# EasyEDA Pro project 电压表指示器.eprj

# Schematic 主板
Create Date: 2023-12-25; Page Name: P1; Project Name: 电压表指示器; Schematic Name: 主板; Update Date: 2024-02-02; Company: 嘉立创EDA; Page Size: A4; Version: V1.0
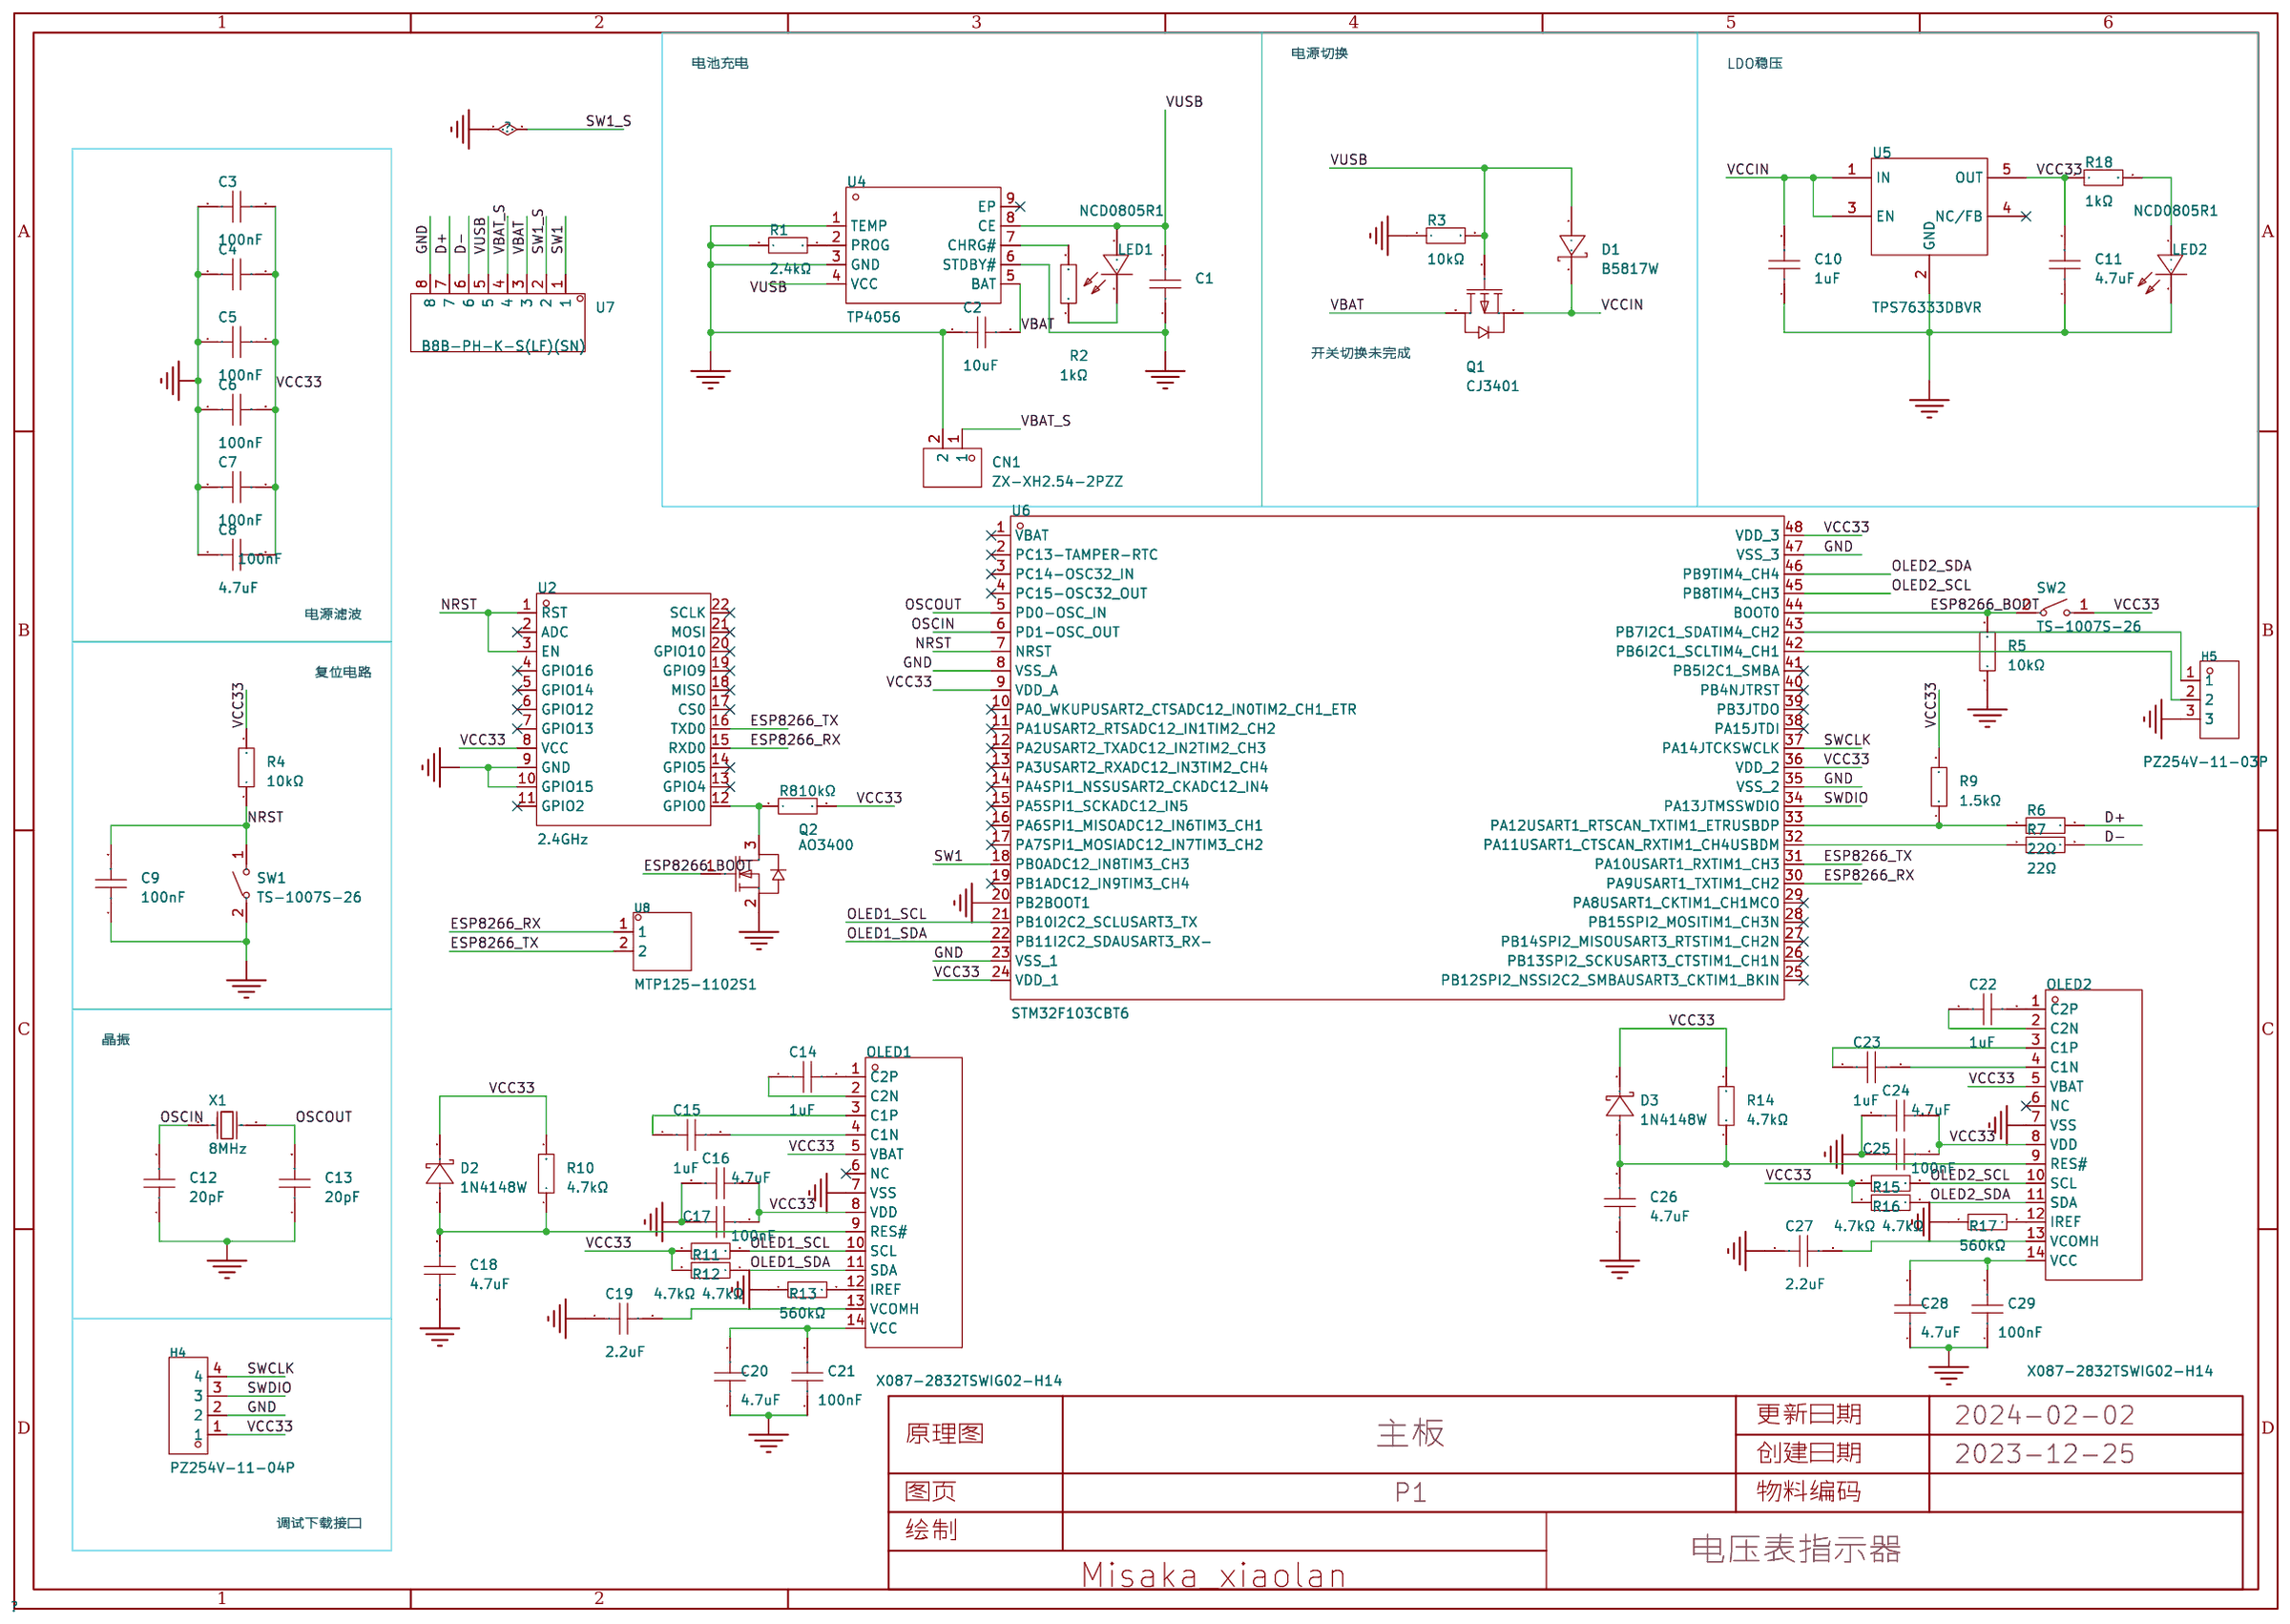
[diagram p0: schematic sheet]

## Parts
C1  10uF  [C0603]
C2  10uF  [C0603]
C3  100nF  [C0603]
C4  100nF  [C0603]
C5  100nF  [C0603]
C6  100nF  [C0603]
C7  100nF  [C0603]
C8  4.7uF  [C0603]
C9  100nF  [C0603]
C10  1uF  [C0603]
C11  4.7uF  [C0603]
C12  20pF  [C0603]
C13  20pF  [C0603]
C14  1uF  [C0603]
C15  1uF  [C0603]
C16  4.7uF  [C0603]
C17  100nF  [C0603]
C18  4.7uF  [C0603]
C19  2.2uF  [C0603]
C20  4.7uF  [C0603]
C21  100nF  [C0603]
C22  1uF  [C0603]
C23  1uF  [C0603]
C24  4.7uF  [C0603]
C25  100nF  [C0603]
C26  4.7uF  [C0603]
C27  2.2uF  [C0603]
C28  4.7uF  [C0603]
C29  100nF  [C0603]
CN1  ZX-XH2.54-2PZZ  [CONN-TH_2P-P2.50_HX25003-2A]
D1  B5817W  [SOD-123_L2.7-W1.6-LS3.7-RD]
D2  1N4148W  [SOD-123_L2.7-W1.6-LS3.7-FD]
D3  1N4148W  [SOD-123_L2.7-W1.6-LS3.7-FD]
H4  PZ254V-11-04P  [HDR-TH_4P-P2.54-V-M]
H5  PZ254V-11-03P  [HDR-TH_3P-P2.54-V-M]
LED1  NCD0805R1  [LED0805-R-RD]
LED2  NCD0805R1  [LED0805-R-RD]
OLED1  X087-2832TSWIG02-H14  [OLED-SMD_X087-2832TSWIG02-H14]
OLED2  X087-2832TSWIG02-H14  [OLED-SMD_X087-2832TSWIG02-H14]
Q1  CJ3401  [SOT-23-3_L2.9-W1.6-P1.90-LS2.8-BR]
Q2  AO3400  [SOT-23_L2.9-W1.3-P1.90-LS2.4-BR]
R1  2.4kΩ  [R0603]
R2  1kΩ  [R0603]
R3  10kΩ  [R0603]
R4  10kΩ  [R0603]
R5  10kΩ  [R0603]
R6  22Ω  [R0603]
R7  22Ω  [R0603]
R8  10kΩ  [R0603]
R9  1.5kΩ  [R0603]
R10  4.7kΩ  [R0603]
R11  4.7kΩ  [R0603]
R12  4.7kΩ  [R0603]
R13  560kΩ  [R0603]
R14  4.7kΩ  [R0603]
R15  4.7kΩ  [R0603]
R16  4.7kΩ  [R0603]
R17  560kΩ  [R0603]
R18  1kΩ  [R0603]
SW1  TS-1007S-26  [SW-SMD_L6.1-W3.7-LS7.9]
SW2  TS-1007S-26  [SW-SMD_L6.1-W3.7-LS7.9]
U2  2.4GHz  [WIFIM-SMD_ESP-12F-ESP8266MOD]
U4  TP4056  [ESOP-8_L4.9-W3.9-P1.27-LS6.0-BL-EP]
U5  TPS76333DBVR  [SOT-23-5_L3.0-W1.7-P0.95-LS2.8-BR]
U6  STM32F103CBT6  [LQFP-48_L7.0-W7.0-P0.50-LS9.0-BL]
U7  B8B-PH-K-S(LF)(SN)  [CONN-TH_B8B-PH-K-S-LF-SN]
U8  MTP125-1102S1  [HDR-TH_2P-P2.54-V-M-1]
X1  8MHz  [CRYSTAL-SMD_L11.5-W4.8-LS12.7]

## Library data of the parts
C1 C2 = CL10A106MQ8NNNC: 容值:10uF;精度:±20%;额定电压:6.3V;材质(温度系数):X5R;; LCSC Part Name: 10uF ±20% 6.3V; Supplier Part: C1691; Manufacturer: SAMSUNG(三星); Supplier Footprint: 0603; JLCPCB Part Class: Extended Part; Datasheet: https://atta.szlcsc.com/upload/public/pdf/source/20160218/1457707763339.pdf; Supplier: LCSC; Tolerance: ±20%; Voltage Rated: 6.3V; Temperature Coefficient: X5R
C3-C7 C9 C17 C21 C25 C29 = TCC0603X7R104K500CT: 容值:100nF;精度:±10%;额定电压:50V;材质(温度系数):X7R;; LCSC Part Name: 100nF ±10% 50V; Supplier Part: C282519; Manufacturer: CCTC(三环); Supplier Footprint: 0603; JLCPCB Part Class: Extended Part; Datasheet: https://atta.szlcsc.com/upload/public/pdf/source/20191203/C466239_F62A586702D44EEA1C39B32FC8662B21.pdf; Supplier: LCSC; Tolerance: ±10%; Voltage Rated: 50V; Temperature Coefficient: X7R
C8 C11 C16 C18 C20 C24 C26 C28 = CL10A475KQ8NNNC: 容值:4.7uF;精度:±10%;额定电压:6.3V;材质(温度系数):X5R;; LCSC Part Name: 4.7uF ±10% 6.3V; Supplier Part: C8032; Manufacturer: SAMSUNG(三星); Supplier Footprint: 0603; JLCPCB Part Class: Extended Part; Datasheet: https://atta.szlcsc.com/upload/public/pdf/source/20221010/F95B0006E4929BBC4EB5850E0BA49567.pdf; Supplier: LCSC; Tolerance: ±10%; Voltage Rated: 6.3V; Temperature Coefficient: X5R
C10 C14 C15 C22 C23 = CL10A105KO8NNNC: 容值:1uF;精度:±10%;额定电压:16V;材质(温度系数):X5R;; LCSC Part Name: 1uF ±10% 16V; Supplier Part: C1592; Manufacturer: SAMSUNG(三星); Supplier Footprint: 0603; JLCPCB Part Class: Extended Part; Datasheet: https://atta.szlcsc.com/upload/public/pdf/source/20220919/9FBE606BE0D9532D730F292EB26DC5BB.pdf; Supplier: LCSC; Tolerance: ±10%; Voltage Rated: 16V; Temperature Coefficient: X5R
C12 C13 = CC0603JRNPO9BN200: 容值:20pF;精度:±5%;额定电压:50V;材质(温度系数):NP0;; LCSC Part Name: 20pF ±5% 50V; Supplier Part: C105621; Manufacturer: YAGEO(国巨); Supplier Footprint: 0603; JLCPCB Part Class: Extended Part; Datasheet: https://atta.szlcsc.com/upload/public/pdf/source/20170505/1493957838062.pdf; Supplier: LCSC; Tolerance: ±5%; Voltage Rated: 50V; Temperature Coefficient: NP0
C19 C27 = CL10A225KO8NNNC: 容值:2.2uF;精度:±10%;额定电压:16V;材质(温度系数):X5R;; LCSC Part Name: 2.2uF ±10% 16V; Supplier Part: C23630; Manufacturer: SAMSUNG(三星); Supplier Footprint: 0603; JLCPCB Part Class: Basic Part; Datasheet: https://atta.szlcsc.com/upload/public/pdf/source/20160218/1457707763339.pdf; Supplier: LCSC; Tolerance: ±10%; Voltage Rated: 16V; Temperature Coefficient: X5R
CN1 = ZX-XH2.54-2PZZ: 插针结构:1x2P;间距:2.54mm;安装方式:直插;行距:-;总PIN数:2P;排数:1;每排PIN数:2;参考系列:XH;额定电流:3A;触头材质:黄铜;触头镀层:锡;工作温度范围:-25℃~+85℃;; LCSC Part Name: 1x2P 间距:2.54mm 直插 系列:XH; Supplier Part: C7429632; Manufacturer: Megastar(兆星); Supplier Footprint: 插件,P=2.54mm; JLCPCB Part Class: Extended Part; Datasheet: https://atta.szlcsc.com/upload/public/pdf/source/20230619/19BA6947230AA44A04D3EDD65E618FD0.pdf; Supplier: LCSC; Pins Structure: 1x2P; Pitch: 2.54mm; Mounting Style: 直插; Number of Pins: 2P; Number of Rows: 1; Number of PINs Per Row: 2; Reference Series: XH; Current Rating (Max): 3A; Contact Material: 黄铜; Contact Plating: 锡; Operating Temperature Range: -25℃~+85℃
D1 = B5817W_C511870: 正向压降(Vf):750mV@3A;直流反向耐压(Vr):20V;平均整流电流(Io):1A;; LCSC Part Name: 电压:20V 电流:1A; Supplier Part: C511870; Manufacturer: BORN(伯恩半导体); Supplier Footprint: SOD-123; JLCPCB Part Class: 扩展库; Datasheet: https://atta.szlcsc.com/upload/public/pdf/source/20200413/C511870_62B338FDEC2CADE0DB74DDD9EC04EFF4.pdf; Supplier: LCSC; Forward Voltage (Vf@If): 750mV@3A; Reverse Voltage (Vr): 20V; Average Rectified Current (Io): 1A
D2 D3 = 1N4148W_C7420318: 二极管配置:独立式;正向压降(Vf):1.25V@150mA;直流反向耐压(Vr):100V;平均整流电流(Io):150mA;功率:400mW;反向恢复时间(trr):4ns;; LCSC Part Name: 电压:100V 电流:150mA; Supplier Part: C7420318; Manufacturer: 宏迦橙; Supplier Footprint: SOD-123; JLCPCB Part Class: 扩展库; Datasheet: https://atta.szlcsc.com/upload/public/pdf/source/20230828/E5C3F7A4272052930A7E03B75759BF50.pdf; Supplier: LCSC; Diode Configuration: 独立式; Forward Voltage (Vf@If): 1.25V@150mA; Reverse Voltage (Vr): 100V; Average Rectified Current (Io): 150mA; Power Dissipation: 400mW; Reverse Leakage Current: 1uA@75V; Reverse Recovery Time (trr): 4ns; Operating Temperature: -55℃~+150℃
H4 = PZ254V-11-04P: 排数:单排;总PIN位数:4P;间距:2.54mm;插针结构:1x4P;行距:-;安装类型:直插;圆针/方针:方针;额定电流:3A;额定电压:250V;配合针长度:6mm;塑高:2.5mm;端接针长度:3mm;触头材质:-;工作温度范围:-40℃~+105℃;颜色:黑色;; LCSC Part Name: 2.54mm 1x4P 直插 方针; Supplier Part: C2691448; Manufacturer: XFCN(兴飞); Supplier Footprint: 插件,P=2.54mm; JLCPCB Part Class: 扩展库; Datasheet: https://atta.szlcsc.com/upload/public/pdf/source/20200309/C492403_F9F19131791D08044AD4F84F8E751A34.pdf; Supplier: LCSC; Number of Rows: 单排; Number of Pins: 4P; Pitch: 2.54mm; Pin Structure: 1x4P; Mounting Type: 直插; Circluar Pins/Square Pins: 方针; Current Rating (Max): 3A; Voltage Rating (Max): 250V; Length of Mating Pin: 6mm; Insulation Height: 2.5mm; Length of End Connection Pin: 3mm; Operating Temperature Range: -40℃~+105℃; Color: 黑色
H5 = PZ254V-11-03P: 排数:单排;总PIN位数:3;间距:2.54mm;插针结构:1x3P;行距:-;安装类型:直插;圆针/方针:方针;额定电流:3A;额定电压:250V;配合针长度:6mm;塑高:2.5mm;端接针长度:3mm;工作温度范围:-40℃~+105℃;颜色:黑色;; LCSC Part Name: 2.54mm 1x3P 直插 方针; Supplier Part: C2937625; Manufacturer: XFCN(兴飞); Supplier Footprint: 直插,P=2.54mm; JLCPCB Part Class: Extended Part; Datasheet: 2022-07-12/581362A/62b9d00620994b3696be7eb4af85ad72/双排排针和单排排针.pdf; Supplier: LCSC; Number of Rows: 单排; Number of Pins: 3; Pitch: 2.54mm; Pin Structure: 1x3P; Mounting Type: 直插; Circluar Pins/Square Pins: 方针; Current Rating (Max): 3A; Voltage Rating (Max): 250V; Length of Mating Pin: 6mm; Insulation Height: 2.5mm; Length of End Connection Pin: 3mm; Operating Temperature Range: -40℃~+105℃; Color: 黑色
LED1 LED2 = NCD0805R1: 发光颜色:红色;二极管配置:-;功率:65mW;透镜颜色:无色透明;主波长:615nm~630nm;色温:-;发光强度:67mcd~195mcd;发光角度:130°;安装方式:-;工作温度:-30℃~+85℃;; LCSC Part Name: 红灯 0805红灯   正贴; Supplier Part: C84256; Manufacturer: 国星光电; Supplier Footprint: 0805; JLCPCB Part Class: Basic Part; Datasheet: https://atta.szlcsc.com/upload/public/pdf/source/20200820/C84256_F0A75A43B3EAD75808600A0514C76B99.pdf; Supplier: LCSC; Emitted Color: 红色; Forward Voltage (VF): 1.6V~2.6V; Forward Current: 20mA; Power Dissipation: 65mW; Lens Color: 无色透明; Dominant Wavelength: 615nm~630nm; Luminous Intensity: 67mcd~195mcd; Viewing Angle: 130°; Operating Temperature: -30℃~+85℃
OLED1 OLED2 = X087-2832TSWIG02-H14: 显示屏; Supplier Part: C18723015; Manufacturer: Newvision(新智景); JLCPCB Part Class: Extended Part; Datasheet: https://atta.szlcsc.com/upload/public/pdf/source/20231103/222F0746A2795BBD5263EDDBD3E1B824.pdf; Supplier: LCSC
Q1 = CJ3401: 类型:P沟道;漏源电压(Vdss):30V;连续漏极电流(Id):4.2A;功率(Pd):350mW;导通电阻(RDS(on)@Vgs,Id):65mΩ@10V,4.2A;; LCSC Part Name: P沟道 30V 4.2A; Supplier Part: C13799; Manufacturer: CJ(江苏长电/长晶); Supplier Footprint: SOT-23; JLCPCB Part Class: 扩展库; Datasheet: https://atta.szlcsc.com/upload/public/pdf/source/20140815/1457707217656.pdf; Supplier: LCSC; Type: P沟道; Drain Source Voltage (Vdss): 30V; Continuous Drain Current (Id): 4.2A; Power Dissipation (Pd): 350mW; Drain Source On Resistance (RDS(on)@Vgs,Id): 65mΩ@10V,4.2A; Gate Threshold Voltage (Vgs(th)@Id): 1.3V@250uA
Q2 = AO3400_C2938367: 类型:N沟道;漏源电压(Vdss):30V;连续漏极电流(Id):5.8A;功率(Pd):1.5W;导通电阻(RDS(on)@Vgs,Id):35mΩ@10V,5.8A;阈值电压(Vgs(th)@Id):1.2V@250uA;; LCSC Part Name: N沟道 耐压:30V 电流:5.8A; Supplier Part: C2938367; Manufacturer: GOODWORK(固得沃克); Supplier Footprint: SOT-23; JLCPCB Part Class: 扩展库; Datasheet: https://atta.szlcsc.com/upload/public/pdf/source/20211229/1DE691E24B5B31BB262C463D0489A9AB.pdf; Supplier: LCSC; Type: N沟道; Drain Source Voltage (Vdss): 30V; Continuous Drain Current (Id): 5.8A; Power Dissipation (Pd): 1.5W; Drain Source On Resistance (RDS(on)@Vgs,Id): 35mΩ@10V,5.8A; Gate Threshold Voltage (Vgs(th)@Id): 1.2V@250uA; Input Capacitance (Ciss@Vds): 1.05nF@15V; Reverse Transfer Capacitance (Crss@Vds): 77pF@15V
R1 = 0603WAF2401T5E: 阻值:2.4kΩ;精度:±1%;功率:100mW;温度系数:±100ppm/℃;电阻类型:厚膜电阻;; LCSC Part Name: 2.4kΩ ±1% 100mW 厚膜电阻; Supplier Part: C22940; Manufacturer: UNI-ROYAL(厚声); Supplier Footprint: 0603; JLCPCB Part Class: Basic Part; Datasheet: https://atta.szlcsc.com/upload/public/pdf/source/20200306/C422600_1E6D84923E4A46A82E41ADD87F860B5C.pdf; Supplier: LCSC; Tolerance: ±1%; Power(Watts): 100mW; Overload Voltage (Max): 75V; Temperature Coefficient: ±100ppm/℃; Type: 厚膜电阻; Operating Temperature Range: -55℃~+155℃
R2 R18 = 0603WAF1001T5E: 阻值:1kΩ;精度:±1%;功率:100mW;温度系数:±100ppm/℃;电阻类型:厚膜电阻;; LCSC Part Name: 1kΩ ±1% 100mW 厚膜电阻; Supplier Part: C21190; Manufacturer: UNI-ROYAL(厚声); Supplier Footprint: 0603; JLCPCB Part Class: Basic Part; Datasheet: https://atta.szlcsc.com/upload/public/pdf/source/20200306/C422600_1E6D84923E4A46A82E41ADD87F860B5C.pdf; Supplier: LCSC; Tolerance: ±1%; Power(Watts): 100mW; Overload Voltage (Max): 75V; Temperature Coefficient: ±100ppm/℃; Type: 厚膜电阻; Operating Temperature Range: -55℃~+155℃
R3-R5 R8 = SC0603J1002F2BNRH: 阻值:10kΩ;精度:±5%;功率:-;温度系数:±100ppm/℃;; LCSC Part Name: 10kΩ ±5%; Supplier Part: C3152154; Manufacturer: Sunway(信维通信); Supplier Footprint: 0603; JLCPCB Part Class: Extended Part; Datasheet: https://atta.szlcsc.com/upload/public/pdf/source/20220728/FFCE43BB6DF8FA16AEE331F0F4B289DE.pdf; Supplier: LCSC; Tolerance: ±5%; Temperature Coefficient: ±100ppm/℃; Overload Voltage (Max): 150V; Type: 厚膜电阻; Operating Temperature Range: -55℃~+155℃
R6 R7 = RS-03K220JT: 精度:±5%;温度系数:±100ppm/℃;功率:100mW;阻值:22Ω;最大工作电压:50V;工作温度范围:-55℃~+155℃;; LCSC Part Name: 22Ω(220) ±5%; Supplier Part: C96423; Manufacturer: FH(风华); Supplier Footprint: 0603; JLCPCB Part Class: Extended Part; Datasheet: https://atta.szlcsc.com/upload/public/pdf/source/20171212/C96423_15130640232351178030.pdf; Supplier: LCSC; Tolerance: ±5%; Temperature Coefficient: ±100ppm/℃; Power(Watts): 100mW; Overload Voltage (Max): 50V; Operating Temperature Range: -55℃~+155℃; Type: 厚膜电阻
R9 = 0603WAJ0152T5E: 阻值:1.5kΩ;精度:±5%;功率:100mW;温度系数:±100ppm/℃;电阻类型:厚膜电阻;; LCSC Part Name: 1.5kΩ ±5% 100mW 厚膜电阻; Supplier Part: C25989; Manufacturer: UNI-ROYAL(厚声); Supplier Footprint: 0603; JLCPCB Part Class: Extended Part; Datasheet: https://atta.szlcsc.com/upload/public/pdf/source/20200306/C422600_1E6D84923E4A46A82E41ADD87F860B5C.pdf; Supplier: LCSC; Tolerance: ±5%; Power(Watts): 100mW; Overload Voltage (Max): 75V; Temperature Coefficient: ±100ppm/℃; Type: 厚膜电阻; Operating Temperature Range: -55℃~+155℃
R10-R12 R14-R16 = RTT03472JTP: 电阻类型:厚膜电阻;阻值:4.7kΩ;精度:±5%;功率:100mW;; LCSC Part Name: 4.7kΩ ±5% 100mW; Supplier Part: C103662; Manufacturer: RALEC(旺诠); Supplier Footprint: 0603; JLCPCB Part Class: Extended Part; Datasheet: https://atta.szlcsc.com/upload/public/pdf/source/20170408/1491646290802.pdf; Supplier: LCSC; Type: 厚膜电阻; Tolerance: ±5%; Power(Watts): 100mW; Temperature Coefficient: ±100ppm/℃; Overload Voltage (Max): 75V; Operating Temperature Range: -55℃~+155℃
R13 R17 = 0603WAF5603T5E: 阻值:560kΩ;精度:±1%;功率:100mW;温度系数:±100ppm/℃;电阻类型:厚膜电阻;; LCSC Part Name: 560kΩ ±1% 100mW 厚膜电阻; Supplier Part: C23203; Manufacturer: UNI-ROYAL(厚声); Supplier Footprint: 0603; JLCPCB Part Class: Basic Part; Datasheet: https://atta.szlcsc.com/upload/public/pdf/source/20200306/C422600_1E6D84923E4A46A82E41ADD87F860B5C.pdf; Supplier: LCSC; Tolerance: ±1%; Power(Watts): 100mW; Overload Voltage (Max): 75V; Temperature Coefficient: ±100ppm/℃; Type: 厚膜电阻; Operating Temperature Range: -55℃~+155℃
SW1 SW2 = TS-1007S-26: 电路结构:单刀单掷;触点电流:50mA;额定电压(DC):12V;安装方式:立贴;带灯:-;机械寿命:-;; LCSC Part Name: 6.1*3.6*2.5mm 立贴 轻触开关; Supplier Part: C455236; Manufacturer: XUNPU(讯普); Supplier Footprint: SMD,3.6x6.1mm; JLCPCB Part Class: 扩展库; Datasheet: https://atta.szlcsc.com/upload/public/pdf/source/20191118/C455236_7E7538F01DDF6B1FD919FA3ED2D84847.pdf; Supplier: LCSC; Circuit: 单刀单掷; Actuator Style: 矩形按钮; Switch Length: 6.1mm; Switch Width: 3.6mm; Switch Height: 2.5mm; Contact Current: 50mA; Voltage Rating (DC): 12V; Mounting Style: 立贴
U2 = ESP-12F(ESP8266MOD): 频率:2.4GHz;发射功率:16dBm;核心处理器:ESP8266;天线形式:PCB 板载天线;接收灵敏度:-90dBm;; LCSC Part Name: 完整的802.11b/g/n Wi-Fi的SoC模块; Supplier Part: C82891; Manufacturer: Ai-Thinker(安信可); Supplier Footprint: SMD,16x24mm; JLCPCB Part Class: 扩展库; Datasheet: https://atta.szlcsc.com/upload/public/pdf/source/20210219/C82891_ABD84A460F4F056A2757267CCCA4B508.pdf; Supplier: LCSC; Output Power: 16dBm; Core Processor: ESP8266; Support Interface: GPIO；UART；I2C；PWM；SPI；ADC; Antenna Type: PCB 板载天线; Wireless Standard: 802.11b/g/n; Operating Voltage: 3.3V; Receive  Current: 120mA; Send  Current: 170mA; Sensitivity: -90dBm; Operating Temperature: -40℃~+85℃
U4 = TP4056_C725790: Supplier Part: C725790; Manufacturer: UMW(友台半导体); Supplier Footprint: ESOP-8; JLCPCB Part Class: 扩展库; Datasheet: https://atta.szlcsc.com/upload/public/pdf/source/20231109/CF74897CE79A500F7FE27A45ADCCC631.pdf; Supplier: LCSC
U5 = TPS76333DBVR: 输出类型:固定;最大输入电压:10V;输出电流:150mA;输出电压（最小值/固定值）:3.3V;; Supplier Part: C7100; Manufacturer: TI(德州仪器); Supplier Footprint: SOT-23-5; JLCPCB Part Class: 扩展库; Datasheet: https://atta.szlcsc.com/upload/public/pdf/source/20140704/1457707103369.pdf; Supplier: LCSC
U6 = STM32F103CBT6: CPU内核:ARM Cortex-M3;CPU最大主频:72MHz;程序存储容量:128KB;程序存储器类型:FLASH;RAM总容量:20KB;GPIO端口数量:37;; LCSC Part Name: ARM Cortex-M3 72MHz; Supplier Part: C8304; Manufacturer: ST(意法半导体); Supplier Footprint: LQFP-48(7x7); JLCPCB Part Class: Extended Part; Datasheet: https://atta.szlcsc.com/upload/public/pdf/source/20140724/1457707170379.pdf; Supplier: LCSC; CPU Core: ARM Cortex-M3; CPU Maximum Speed: 72MHz; Operating Voltage Range: 2V~3.6V; Program Storage Size: 128KB; Program Memory Type: FLASH; RAM Size: 20KB; GPIO Ports Number: 37; ADC (Bit): 12bit; Universal Serial Bus: 有; Peripheral/Function: DMA；片载温度传感器；PWM; Watchdog: 有; Infrared Data Association: 有; Low-Voltage Detect: 有; Direct Memory Access: 有; Internal Oscillator: 有; Operating Temperature Range: -40℃~+85℃
U7 = B8B-PH-K-S(LF)(SN): 插针结构:1x8P;间距:2mm;安装方式:-;行距:-;总PIN数:8P;排数:1;每排PIN数:8;参考系列:PH;触头材质:黄铜;; LCSC Part Name: 1x8P 间距:2mm 系列:PH; Supplier Part: C157974; Manufacturer: JST; Supplier Footprint: 插件,P=2mm; JLCPCB Part Class: 扩展库; Datasheet: https://atta.szlcsc.com/upload/public/pdf/source/20181010/C265101_22107ACC4D8714694FDA2DD97145FA81.pdf; Supplier: LCSC; Pins Structure: 1x8P; Pitch: 2mm; Number of Pins: 8P; Number of Rows: 1; Number of PINs Per Row: 8; Reference Series: PH; Contact Material: 黄铜
U8 = MTP125-1102S1: 排数:单排;总PIN位数:2P;间距:2.54mm;插针结构:1x2P;行距:-;安装类型:直插;圆针/方针:方针;额定电流:-;额定电压:-;配合针长度:6mm;塑高:2.5mm;端接针长度:3mm;触头材质:黄铜;触头镀层:-;工作温度范围:-40℃~+105℃;颜色:黑色;; LCSC Part Name: 2.54mm 1x2P 直插 方针 尖头 20181219110956; Supplier Part: C358684; Manufacturer: MINTRON(明硕); Supplier Footprint: 插件,P=2.54mm; JLCPCB Part Class: 扩展库; Datasheet: https://atta.szlcsc.com/upload/public/pdf/source/20190124/C358691_14EEE47B6F852A185E1BED738B24D535.pdf; Supplier: LCSC; Number of Rows: 单排; Number of Pins: 2P; Pitch: 2.54mm; Pin Structure: 1x2P; Mounting Type: 直插; Circluar Pins/Square Pins: 方针; Length of Mating Pin: 6mm; Insulation Height: 2.5mm; Length of End Connection Pin: 3mm; Contact Material: 黄铜; Operating Temperature Range: -40℃~+105℃; Color: 黑色
X1 = X49SM8MSD2SC: 晶振类型:49SMD晶振;频率:8MHz;频率公差:±20ppm;负载电容:20pF;频率稳定度:±30ppm;; LCSC Part Name: 8MHz ±20ppm 20pF; Supplier Part: C12674; Manufacturer: YXC(扬兴晶振); Supplier Footprint: HC-49S-SMD; JLCPCB Part Class: 基础库; Datasheet: https://atta.szlcsc.com/upload/public/pdf/source/20210329/C106809_0E91E60850A780B284B63D653DC40EA4.pdf; Supplier: LCSC; Crystal Type: 49SMD晶振; Frequency Tolerance: ±20ppm; Load Capacitance: 20pF; Frequency Stability: ±30ppm; Operating Temperature: -20℃~+70℃

## Nets
GND: C1.1 C2.2 C3.1 C4.1 C5.1 C6.1 C7.1 C8.1 C9.1 C10.1 C11.1 C12.1 C13.1 C16.1 C17.1 C18.1 C19.1 C20.1 C21.1 C24.1 C25.1 C26.1 C27.1 C28.1 C29.1 CN1.2 H4.2 H5.3 LED2.2(-) OLED1.7(VSS) OLED2.7(VSS) Q2.2(S) R1.1 R3.1 R5.1 R13.1 R17.1 SW1.2(B) U2.9(GND) U2.10(GPIO15) U4.1(TEMP) U4.3(GND) U4.6(STDBY#) U5.2(GND) U6.8(VSS_A) U6.20(PB2BOOT1) U6.23(VSS_1) U6.35(VSS_2) U6.47(VSS_3) U7.2 U7.8
VBAT: C2.1 Q1.3(D) U4.5(BAT) U7.3
VBAT_S: CN1.1 U7.4
VCC33: C3.2 C4.2 C5.2 C6.2 C7.2 C8.2 C11.2 C16.2 C17.2 C24.2 C25.2 D2.2(K) D3.2(K) H4.1 OLED1.5(VBAT) OLED1.8(VDD) OLED2.5(VBAT) OLED2.8(VDD) R4.2 R8.2 R9.2 R10.2 R11.1 R12.2 R14.2 R15.1 R16.2 R18.1 SW2.1(A) U2.8(VCC) U5.5(OUT) U6.9(VDD_A) U6.24(VDD_1) U6.36(VDD_2) U6.48(VDD_3)
VCCIN: C10.2 D1.1(K) Q1.2(S) U5.1(IN) U5.3(EN)
D+: R6.2 U7.7
D-: R7.2 U7.6
ESP8266_BOOT: Q2.1(G) R5.2 SW2.2(B) U6.44(BOOT0)
ESP8266_RX: U2.15(RXD0) U6.30(PA9USART1_TXTIM1_CH2) U8.1
ESP8266_TX: U2.16(TXD0) U6.31(PA10USART1_RXTIM1_CH3) U8.2
NRST: C9.2 R4.1 SW1.1(A) U2.1(RST) U2.3(EN) U6.7(NRST)
OLED1_SCL: OLED1.10(SCL) R11.2 U6.21(PB10I2C2_SCLUSART3_TX)
OLED1_SDA: OLED1.11(SDA) R12.1 U6.22(PB11I2C2_SDAUSART3_RX-)
OLED2_SCL: OLED2.10(SCL) R15.2 U6.45(PB8TIM4_CH3)
OLED2_SDA: OLED2.11(SDA) R16.1 U6.46(PB9TIM4_CH4)
OSCIN: C12.2 U6.6(PD1-OSC_OUT) X1.2(OSC2)
OSCOUT: C13.2 U6.5(PD0-OSC_IN) X1.1(OSC1)
SW1: U6.18(PB0ADC12_IN8TIM3_CH3) U7.1
SWCLK: H4.4 U6.37(PA14JTCKSWCLK)
SWDIO: H4.3 U6.34(PA13JTMSSWDIO)
VUSB: C1.2 D1.2(A) LED1.1(+) Q1.1(G) R3.2 U4.4(VCC) U4.8(CE) U7.5
$1N1538: R1.2 U4.2(PROG)
$1N1811: R2.2 U4.7(CHRG#)
$1N4842: R6.1 R9.1 U6.33(PA12USART1_RTSCAN_TXTIM1_ETRUSBDP)
$1N4845: R7.1 U6.32(PA11USART1_CTSCAN_RXTIM1_CH4USBDM)
$1N4965: Q2.3(D) R8.1 U2.12(GPIO0)
$1N5760: C14.2 OLED1.1(C2P)
$1N5788: C14.1 OLED1.2(C2N)
$1N5816: C15.1 OLED1.3(C1P)
$1N5820: C15.2 OLED1.4(C1N)
$1N6266: C18.2 D2.1(A) OLED1.9(RES#) R10.1
$1N6421: OLED1.12(IREF) R13.2
$1N6524: C19.2 OLED1.13(VCOMH)
$1N6632: C20.2 C21.2 OLED1.14(VCC)
$1N7134: C22.2 OLED2.1(C2P)
$1N7136: C22.1 OLED2.2(C2N)
$1N7139: C23.1 OLED2.3(C1P)
$1N7142: C23.2 OLED2.4(C1N)
$1N7156: C26.2 D3.1(A) OLED2.9(RES#) R14.1
$1N7178: OLED2.12(IREF) R17.2
$1N7182: C27.2 OLED2.13(VCOMH)
$1N7188: C28.2 C29.2 OLED2.14(VCC)
$1N10261: H5.1 U6.43(PB7I2C1_SDATIM4_CH2)
$1N10265: H5.2 U6.42(PB6I2C1_SCLTIM4_CH1)
Net-(LED1-2): LED1.2(-) R2.1
Net-(LED2-1): LED2.1(+) R18.2

Not connected (* = marked no-connect by the designer): OLED1 6(NC)*; OLED2 6(NC)*; U2 2(ADC)* 4(GPIO16)* 5(GPIO14)* 6(GPIO12)* 7(GPIO13)* 11(GPIO2)* 13(GPIO4)* 14(GPIO5)* 17(CS0)* 18(MISO)* 19(GPIO9)* 20(GPIO10)* 21(MOSI)* 22(SCLK)*; U4 9(EP)*; U5 4(NC/FB)*; U6 1(VBAT)* 2(PC13-TAMPER-RTC)* 3(PC14-OSC32_IN)* 4(PC15-OSC32_OUT)* 10(PA0_WKUPUSART2_CTSADC12_IN0TIM2_CH1_ETR)* 11(PA1USART2_RTSADC12_IN1TIM2_CH2)* 12(PA2USART2_TXADC12_IN2TIM2_CH3)* 13(PA3USART2_RXADC12_IN3TIM2_CH4)* 14(PA4SPI1_NSSUSART2_CKADC12_IN4)* 15(PA5SPI1_SCKADC12_IN5)* 16(PA6SPI1_MISOADC12_IN6TIM3_CH1)* 17(PA7SPI1_MOSIADC12_IN7TIM3_CH2)* 19(PB1ADC12_IN9TIM3_CH4)* 25(PB12SPI2_NSSI2C2_SMBAUSART3_CKTIM1_BKIN)* 26(PB13SPI2_SCKUSART3_CTSTIM1_CH1N)* 27(PB14SPI2_MISOUSART3_RTSTIM1_CH2N)* 28(PB15SPI2_MOSITIM1_CH3N)* 29(PA8USART1_CKTIM1_CH1MCO)* 38(PA15JTDI)* 39(PB3JTDO)* 40(PB4NJTRST)* 41(PB5I2C1_SMBA)*

## Notes on the sheet
- 电源切换
- 电池充电
- LDO稳压
- 开关切换未完成
- 电源滤波
- 复位电路
- 晶振
- 调试下载接口

# Schematic 接线板
Create Date: 2023-12-30; Page Name: P1; Project Name: 电压表指示器; Schematic Name: 接线板; Update Date: 2023-12-30; Company: 嘉立创EDA; Page Size: A4; Version: V1.0
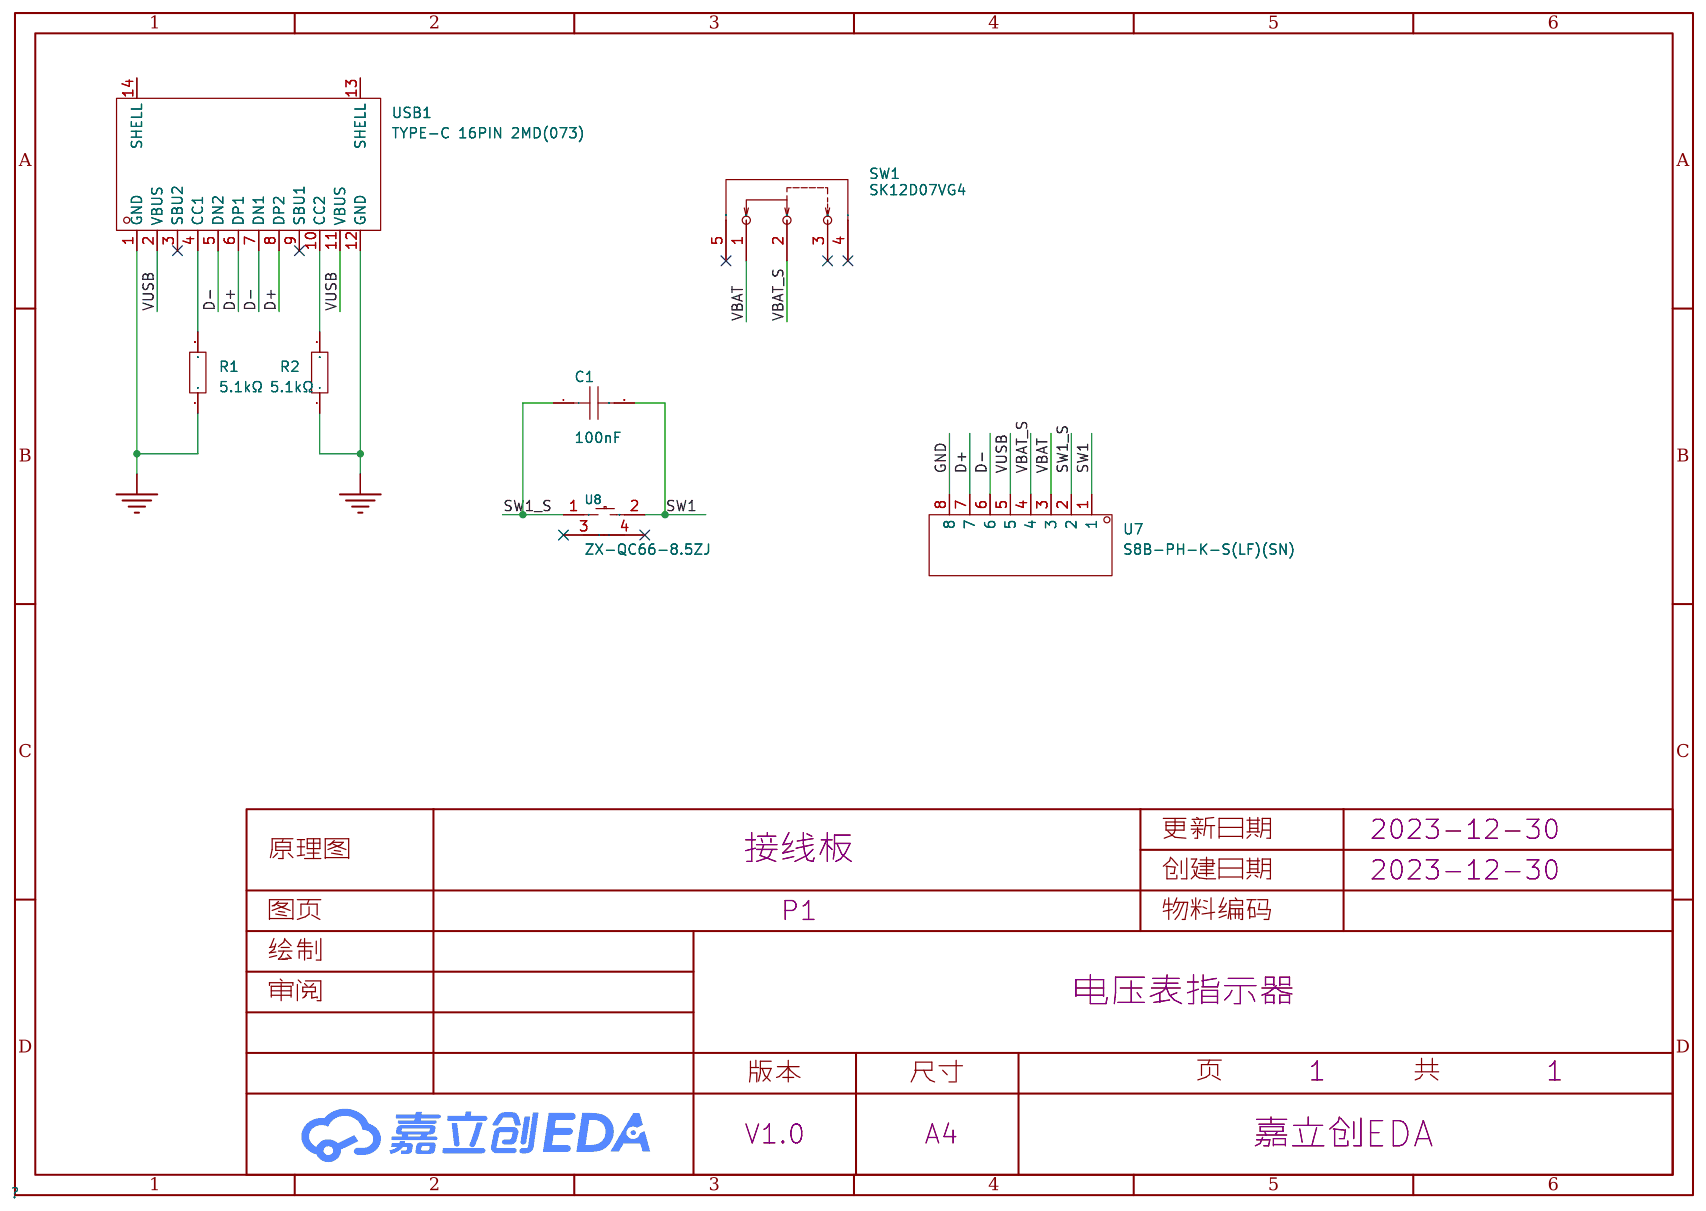
[diagram p1: schematic sheet]

## Parts
C1  100nF  [C0603]
R1  5.1kΩ  [R0603]
R2  5.1kΩ  [R0603]
SW1  SK12D07VG4  [SW-TH_SK12D07VG4]
U7  S8B-PH-K-S(LF)(SN)  [CONN-TH_S8B-PH-K-S-LF-SN]
U8  ZX-QC66-8.5ZJ  [SW-TH_4P-L7.5-W5.5-P4.50]
USB1  TYPE-C 16PIN 2MD(073)  [USB-C-SMD_TYPE-C-6PIN-2MD-073]

## Library data of the parts
C1 = TCC0603X7R104K500CT: 容值:100nF;精度:±10%;额定电压:50V;材质(温度系数):X7R;; LCSC Part Name: 100nF ±10% 50V; Supplier Part: C282519; Manufacturer: CCTC(三环); Supplier Footprint: 0603; JLCPCB Part Class: Extended Part; Datasheet: https://atta.szlcsc.com/upload/public/pdf/source/20191203/C466239_F62A586702D44EEA1C39B32FC8662B21.pdf; Supplier: LCSC; Tolerance: ±10%; Voltage Rated: 50V; Temperature Coefficient: X7R
R1 R2 = 0603WAJ0512T5E: 阻值:5.1kΩ;精度:±5%;功率:100mW;温度系数:±100ppm/℃;电阻类型:厚膜电阻;; LCSC Part Name: 5.1kΩ ±5% 100mW 厚膜电阻; Supplier Part: C26000; Manufacturer: UNI-ROYAL(厚声); Supplier Footprint: 0603; JLCPCB Part Class: Extended Part; Datasheet: https://atta.szlcsc.com/upload/public/pdf/source/20200306/C422600_1E6D84923E4A46A82E41ADD87F860B5C.pdf; Supplier: LCSC; Tolerance: ±5%; Power(Watts): 100mW; Overload Voltage (Max): 75V; Temperature Coefficient: ±100ppm/℃; Type: 厚膜电阻; Operating Temperature Range: -55℃~+155℃
SW1 = SK12D07VG4: 电路结构:单刀双掷;安装方式:卧插;额定电流(DC):500mA;额定电压(DC):50V;额定电流(AC):-;额定电压(AC):-;机械寿命:5千次;; LCSC Part Name: 3脚2档位 卧插 滑动开关; Supplier Part: C393937; Manufacturer: SHOU HAN(首韩); Supplier Footprint: 插件; JLCPCB Part Class: 扩展库; Datasheet: https://atta.szlcsc.com/upload/public/pdf/source/20190521/C393937_939FE26E571CC67D2D532E953108A1B0.pdf; Supplier: LCSC; Circuit: 单刀双掷; Actuator Style: 矩形柱状; Pin Style: PC引脚; Switch Height: 8.8mm; Mounting Style: 卧插; Current Rating (DC): 500mA; Voltage Rating (DC): 50V; Mechanical Life: 5千次
U7 = S8B-PH-K-S(LF)(SN): 插针结构:1x8P;间距:2mm;安装方式:-;行距:-;总PIN数:8P;排数:1;每排PIN数:8;参考系列:PH;触头材质:黄铜;; LCSC Part Name: 1x8P 间距:2mm 系列:PH; Supplier Part: C157915; Manufacturer: JST; Supplier Footprint: 弯插,P=2mm; JLCPCB Part Class: Extended Part; Datasheet: https://atta.szlcsc.com/upload/public/pdf/source/20181010/C265101_22107ACC4D8714694FDA2DD97145FA81.pdf; Supplier: LCSC; Pins Structure: 1x8P; Pitch: 2mm; Number of Pins: 8P; Number of Rows: 1; Number of PINs Per Row: 8; Reference Series: PH; Contact Material: 黄铜
U8 = ZX-QC66-8.5ZJ: 电路结构:单刀单掷;带支架:是;触点电流:50mA;额定电压(AC):250V;额定电压(DC):12V;安装方式:直插;绝缘电阻:100MΩ;作用力:260gf@±50gf;机械寿命:10万次;; LCSC Part Name: 6*6*8.5支架; Supplier Part: C7470146; Manufacturer: Megastar(兆星); Supplier Footprint: DIP; Datasheet: https://atta.szlcsc.com/upload/public/pdf/source/20230724/88965F32F2E27EE87313BEBC4DFA2AE1.pdf; Supplier: LCSC; Circuit: 单刀单掷; Actuator Style: 圆形按钮; Switch Length: 6mm; Switch Width: 6mm; Switch Height: 8.5mm; Strike Gundam: 是; Contact Current: 50mA; Voltage Rating (AC): 250V; Voltage Rating (DC): 12V; Mounting Style: 直插; Insulation Resistance: 100MΩ; Actuator/Cap Color: 黑色; Operating Force: 260gf@±50gf; Pin Style: PC引脚; Mechanical Life: 10万次; Operating Temperature: -30℃~+80℃
USB1 = TYPE-C 16PIN 2MD(073): 连接器类型:Type-C;标准:-;公母:母;端口数量:1;触点数量:16P;安装方式:卧贴;额定电流 - 电源:5A;工作温度范围:-25℃~+85℃;; LCSC Part Name: Type-C 母 卧贴 带定位柱 不锈钢外壳 2次模顶; Supplier Part: C2765186; Manufacturer: SHOU HAN(首韩); Supplier Footprint: SMD; JLCPCB Part Class: 扩展库; Datasheet: https://atta.szlcsc.com/upload/public/pdf/source/20211123/39B17C16241EAC15C5E277BDA434118E.pdf; Supplier: LCSC; Connector Type: Type-C; Gender: 母; Number of Ports: 1; Number of Contacts: 16P; Mounting Style: 卧贴; Current Rating - Power (Max): 5A; Operating Temperature Range: -25℃~+85℃

## Nets
GND: R1.1 R2.1 U7.8 USB1.1(GND) USB1.12(GND)
VBAT: SW1.1 U7.3
VBAT_S: SW1.2 U7.4
D+: U7.7 USB1.6(DP1) USB1.8(DP2)
D-: U7.6 USB1.5(DN2) USB1.7(DN1)
SW1: C1.2 U7.1 U8.2
SW1_S: C1.1 U7.2 U8.1
VUSB: U7.5 USB1.2(VBUS) USB1.11(VBUS)
$1N308: R1.2 USB1.4(CC1)
$1N324: R2.2 USB1.10(CC2)

Not connected (* = marked no-connect by the designer): SW1 3* 4* 5*; U8 3* 4*; USB1 3(SBU2)* 9(SBU1)* 13(SHELL) 14(SHELL)

# Board PCB1
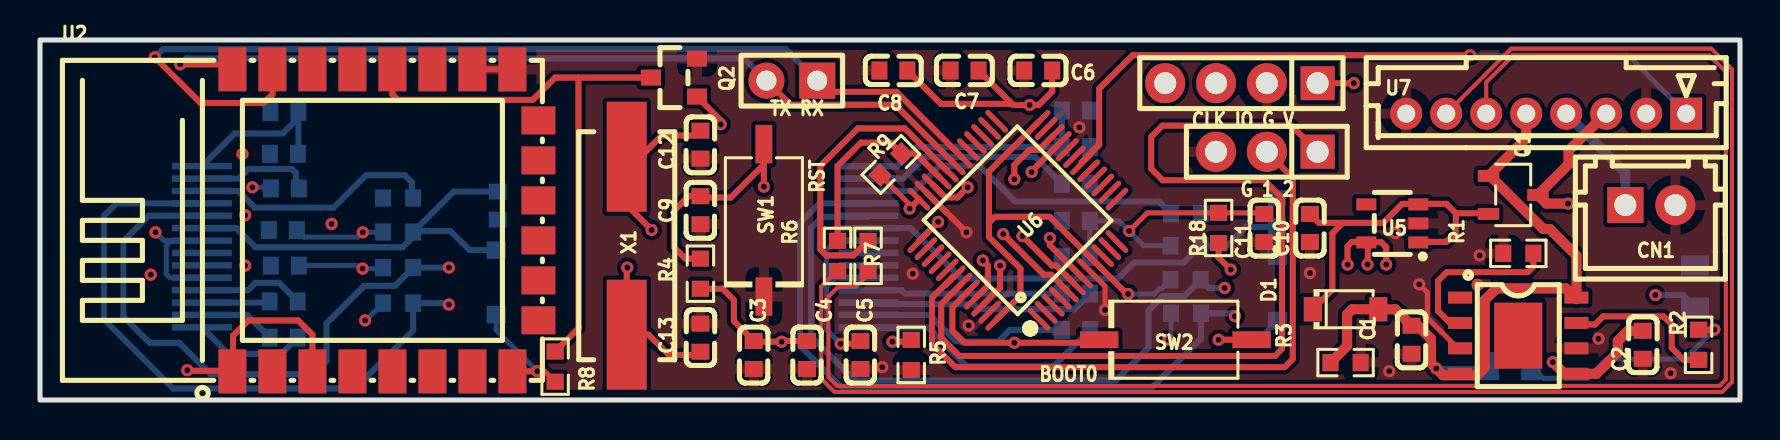
[diagram p2: board, top side]
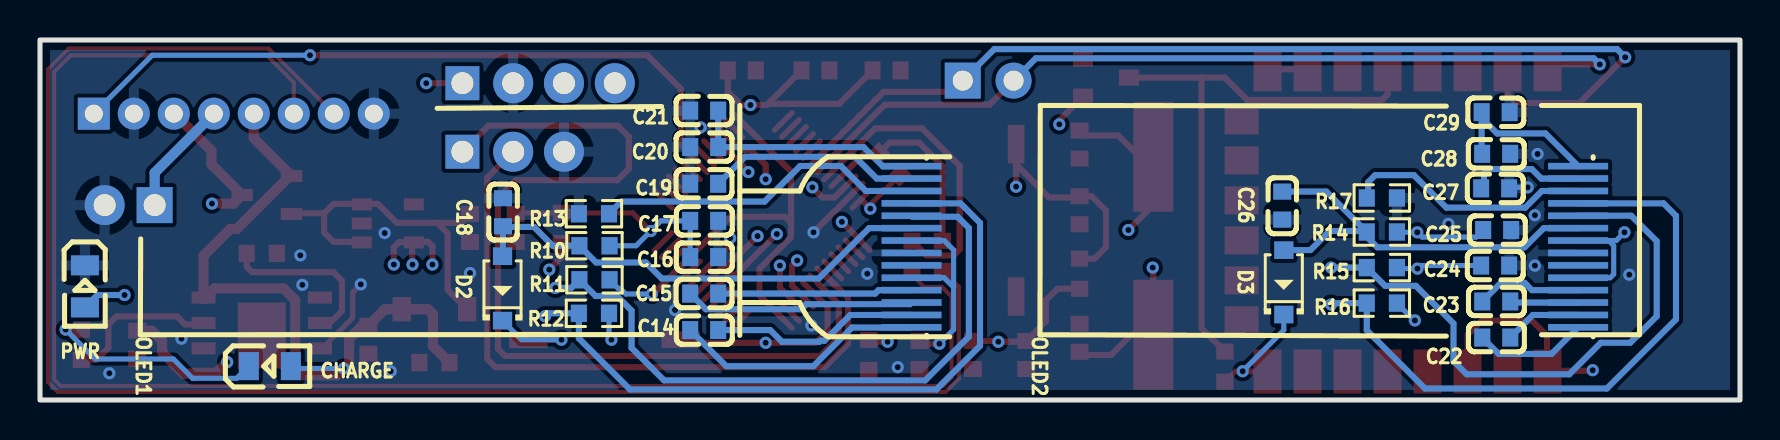
[diagram p3: board, bottom side, seen from below]

Outline 85 x 18 mm; copper layers: Top Layer, GND, VCC, Bottom Layer. Coordinates in mm from the lower left corner of the outline.
Outline path: rectangle 0,18 85,0
Stack: Top Layer 0.035mm 外层铜厚1oz / Dielectric1 0.2104mm 7628 RC49% 8.6mil / GND 0.0152mm 内层铜厚 / Dielectric2 1.065mm 1.1mm H/HOZ 含铜 / VCC 0.0152mm 内层铜厚 / Dielectric3 0.2104mm 7628 RC49% 8.6mil / Bottom Layer 0.035mm 外层铜厚1oz

## Design rules (mm)
template: JLCPCB Capability(Two Layers Board)
spacing copperThickness1oz (default): track to track 0.102, other pairs 0.152 to 0.3
spacing copperThickness2oz: track to track 0.203, other pairs 0.152 to 0.3
track width copperThickness1oz (default): min 0.127, default 0.254, max 2.54
track width copperThickness2oz: min 0.203, default 0.254, max 2.54
differential pair differentialPair (default): width min 0.127, default 0.254, max 2.54; gap min 0.152, default 0.152
via viaSize (default): diameter min 0.5, default 0.61, max 10; hole min 0.3, default 0.305, max 6.3

## Placement (name value [footprint] x y rotation side)
C1  10uF  [C0603]  68.58 3.01 90 top
C2  10uF  [C0603]  80.14 2.76 270 top
C3  100nF  [C0603]  35.69 2.25 90 top
C4  100nF  [C0603]  38.35 2.25 90 top
C5  100nF  [C0603]  41.02 2.25 90 top
C6  100nF  [C0603]  49.91 16.48 0 top
C7  100nF  [C0603]  46.23 16.48 0 top
C8  4.7uF  [C0603]  42.67 16.48 0 top
C9  100nF  [C0603]  33.02 9.49 90 top
C10  1uF  [C0603]  63.5 8.6 90 top
C11  4.7uF  [C0603]  61.21 8.6 90 top
C12  20pF  [C0603]  33.02 12.77 90 top
C13  20pF  [C0603]  33.02 3.12 270 top
C14  1uF  [C0603]  51.79 3.5 0 bottom
C15  1uF  [C0603]  51.79 5.32 180 bottom
C16  4.7uF  [C0603]  51.79 7.14 0 bottom
C17  100nF  [C0603]  51.79 8.96 0 bottom
C18  4.7uF  [C0603]  61.85 9.39 270 bottom
C19  2.2uF  [C0603]  51.79 10.81 180 bottom
C20  4.7uF  [C0603]  51.79 12.65 180 bottom
C21  100nF  [C0603]  51.79 14.47 180 bottom
C22  1uF  [C0603]  12.19 3.12 0 bottom
C23  1uF  [C0603]  12.19 4.93 0 bottom
C24  4.7uF  [C0603]  12.24 6.72 0 bottom
C25  100nF  [C0603]  12.14 8.5 0 bottom
C26  4.7uF  [C0603]  22.89 9.72 90 bottom
C27  2.2uF  [C0603]  12.24 10.58 0 bottom
C28  4.7uF  [C0603]  12.19 12.31 0 bottom
C29  100nF  [C0603]  12.22 14.39 0 bottom
CHARGE  NCD0805R1  [LED0805-R-RD]  73.51 1.69 180 bottom
CN1  ZX-XH2.54-2PZZ  [CONN-TH_2P-P2.50_HX25003-2A]  80.52 9.75 0 top
D1  B5817W  [SOD-123_L2.7-W1.6-LS3.7-RD]  65.28 4.54 0 top
D2  1N4148W  [SOD-123_L2.7-W1.6-LS3.7-FD]  61.87 5.58 270 bottom
D3  1N4148W  [SOD-123_L2.7-W1.6-LS3.7-FD]  22.81 5.88 270 bottom
H4  PZ254V-11-04P  [HDR-TH_4P-P2.54-V-M]  60.07 15.84 180 top
H5  PZ254V-11-03P  [HDR-TH_3P-P2.54-V-M]  61.34 12.41 180 top
OLED1  X087-2832TSWIG02-H14  [OLED-SMD_X087-2832TSWIG02-H14#2]  40.26 7.66 90 bottom
OLED2  X087-2832TSWIG02-H14  [OLED-SMD_X087-2832TSWIG02-H14]  -4.72 7.66 90 bottom
PWR  NCD0805R1  [LED0805-R-RD]  82.75 5.68 270 bottom
Q1  CJ3401  [SOT-23-3_L2.9-W1.6-P1.90-LS2.8-BR]  73.66 10.25 180 top
Q2  AO3400  [SOT-23_L2.9-W1.3-P1.90-LS2.4-BR]  31.7 16.12 0 top
R1  2.4kΩ  [R0603]  73.91 7.33 0 top
R2  1kΩ  [R0603]  82.93 2.76 270 top
R3  10kΩ  [R0603]  65.28 1.87 180 top
R4  10kΩ  [R0603]  33.02 6.32 270 top
R5  10kΩ  [R0603]  43.56 2.25 90 top
R6  22Ω  [R0603]  39.88 7.2 270 top
R7  22Ω  [R0603]  41.4 7.2 270 top
R8  10kΩ  [R0603]  25.76 1.67 270 top
R9  1.5kΩ  [R0603]  42.54 11.78 225 top
R10  4.7kΩ  [R0603]  57.28 7.71 180 bottom
R11  4.7kΩ  [R0603]  57.28 6.01 0 bottom
R12  4.7kΩ  [R0603]  57.3 4.33 180 bottom
R13  560kΩ  [R0603]  57.3 9.31 180 bottom
R14  4.7kΩ  [R0603]  17.91 8.4 180 bottom
R15  4.7kΩ  [R0603]  17.91 6.62 0 bottom
R16  4.7kΩ  [R0603]  17.91 4.84 180 bottom
R17  560kΩ  [R0603]  17.91 10.1 0 bottom
R18  1kΩ  [R0603]  58.93 8.6 270 top
SW1  TS-1007S-26  [SW-SMD_L6.1-W3.7-LS7.9]  36.19 8.98 90 top
SW2  TS-1007S-26  [SW-SMD_L6.1-W3.7-LS7.9]  56.77 3.01 0 top
U2  2.4GHz  [WIFIM-SMD_ESP-12F-ESP8266MOD]  17.27 8.98 0 top
U4  TP4056  [ESOP-8_L4.9-W3.9-P1.27-LS6.0-BL-EP]  73.91 3.22 270 top
U5  TPS76333DBVR  [SOT-23-5_L3.0-W1.7-P0.95-LS2.8-BR]  67.62 8.83 0 top
U6  STM32F103CBT6  [LQFP-48_L7.0-W7.0-P0.50-LS9.0-BL]  48.9 8.98 45 top
U7  B8B-PH-K-S(LF)(SN)  [CONN-TH_B8B-PH-K-S-LF-SN]  75.31 14.32 0 top
U8  MTP125-1102S1  [HDR-TH_2P-P2.54-V-M-1]  37.59 15.97 180 top
X1  8MHz  [CRYSTAL-SMD_L11.5-W4.8-LS12.7]  29.34 7.71 90 top

## Footprints (pads in the part's own frame, mm; a bottom-side part is the same pattern mirrored in y, then rotated)
C0603
  rect 0.8x0.9 smd: 1(-0.7,0) 2(0.7,0)
CONN-TH_2P-P2.50_HX25003-2A
  rect 1.8x1.8 hole 1.1: 1(-1.25,0)
  round 2 hole 1.1: 2(1.25,0)
CONN-TH_B8B-PH-K-S-LF-SN
  rect 1.6x1.6 hole 0.9: 1(7,0)
  round 1.6 hole 0.9: 2(5,0) 3(3,0) 4(1,0) 5(-1,0) 6(-3,0) 7(-5,0) 8(-7,0)
CRYSTAL-SMD_L11.5-W4.8-LS12.7
  rect 5.5x2 smd: 1(-4.45,0) 2(4.45,0)
ESOP-8_L4.9-W3.9-P1.27-LS6.0-BL-EP
  rect 0.6x1.2 smd: 1(-1.905,-2.909) 2(-0.635,-2.909) 3(0.635,-2.909) 4(1.905,-2.909) 5(1.905,2.909) 6(0.635,2.909) 7(-0.635,2.909) 8(-1.905,2.909)
  rect 3.3x2.4 smd: 9(0,0)
HDR-TH_2P-P2.54-V-M-1
  rect 1.8x1.8 hole 1: 1(-1.27,0)
  round 1.8 hole 1: 2(1.27,0)
HDR-TH_3P-P2.54-V-M
  rect 1.7x1.7 hole 1.1: 1(-2.54,0)
  round 2 hole 1.1: 2(0,0) 3(2.54,0)
HDR-TH_4P-P2.54-V-M
  rect 1.7x1.7 hole 1.1: 1(-3.81,0)
  round 2 hole 1.1: 2(-1.27,0) 3(1.27,0) 4(3.81,0)
LED0805-R-RD
  rect 1x1.399 smd: 1(1.05,0) 2(-1.05,0)
LQFP-48_L7.0-W7.0-P0.50-LS9.0-BL
  oval 0.27x1.5 smd: 1(-2.75,-4.25) 2(-2.25,-4.25) 3(-1.75,-4.25) 4(-1.25,-4.25) 5(-0.75,-4.25) 6(-0.25,-4.25) 7(0.25,-4.25) 8(0.75,-4.25) 9(1.25,-4.25) 10(1.75,-4.25) 11(2.25,-4.25) 12(2.75,-4.25) 25(2.75,4.25) 26(2.25,4.25) 27(1.75,4.25) 28(1.25,4.25) 29(0.75,4.25) 30(0.25,4.25) 31(-0.25,4.25) 32(-0.75,4.25) 33(-1.25,4.25) 34(-1.75,4.25) 35(-2.25,4.25) 36(-2.75,4.25)
  oval 1.5x0.27 smd: 13(4.25,-2.75) 14(4.25,-2.25) 15(4.25,-1.75) 16(4.25,-1.25) 17(4.25,-0.75) 18(4.25,-0.25) 19(4.25,0.25) 20(4.25,0.75) 21(4.25,1.25) 22(4.25,1.75) 23(4.25,2.25) 24(4.25,2.75) 37(-4.25,2.75) 38(-4.25,2.25) 39(-4.25,1.75) 40(-4.25,1.25) 41(-4.25,0.75) 42(-4.25,0.25) 43(-4.25,-0.25) 44(-4.25,-0.75) 45(-4.25,-1.25) 46(-4.25,-1.75) 47(-4.25,-2.25) 48(-4.25,-2.75)
OLED-SMD_X087-2832TSWIG02-H14
  rect 0.33x3 smd: 1(-4.03,12.818) 2(-3.41,12.818) 3(-2.79,12.818) 4(-2.17,12.818) 5(-1.55,12.818) 6(-0.93,12.818) 7(-0.31,12.818) 8(0.31,12.818) 9(0.93,12.818) 10(1.55,12.818) 11(2.17,12.818) 12(2.79,12.818) 13(3.41,12.818) 14(4.03,12.818)
OLED-SMD_X087-2832TSWIG02-H14#2
  rect 0.33x3 smd: 1(-4.03,1.163) 2(-3.41,1.163) 3(-2.79,1.163) 4(-2.17,1.163) 5(-1.55,1.163) 6(-0.93,1.163) 7(-0.31,1.163) 8(0.31,1.163) 9(0.93,1.163) 10(1.55,1.163) 11(2.17,1.163) 12(2.79,1.163) 13(3.41,1.163) 14(4.03,1.163)
R0603
  rect 0.806x0.864 smd: 1(-0.753,0) 2(0.753,0)
SOD-123_L2.7-W1.6-LS3.7-FD
  rect 0.88x0.96 smd: 1(-1.61,0) 2(1.61,0)
SOD-123_L2.7-W1.6-LS3.7-RD
  rect 0.91x1.22 smd: 1(-1.635,0) 2(1.635,0)
SOT-23-3_L2.9-W1.6-P1.90-LS2.8-BR
  rect 1.07x0.6 smd: 1(1.235,-0.95) 2(1.235,0.95) 3(-1.235,0)
SOT-23-5_L3.0-W1.7-P0.95-LS2.8-BR
  rect 1x0.6 smd: 1(1.3,-0.95) 2(1.3,0) 3(1.3,0.95) 4(-1.3,0.95) 5(-1.3,-0.95)
SOT-23_L2.9-W1.3-P1.90-LS2.4-BR
  rect 1x0.8 smd: 1(1.15,-0.95) 2(1.15,0.95) 3(-1.15,0)
SW-SMD_L6.1-W3.7-LS7.9
  rect 1.92x0.84 smd: 1(3.81,0) 2(-3.81,0)
WIFIM-SMD_ESP-12F-ESP8266MOD
  rect 1.4x2.2 smd: 1(-7.651,-7.551) 2(-5.651,-7.551) 3(-3.651,-7.551) 4(-1.651,-7.551) 5(0.349,-7.551) 6(2.349,-7.551) 7(4.349,-7.551) 8(6.349,-7.551) 9(6.349,7.548) 10(4.349,7.55) 11(2.349,7.551) 12(0.349,7.551) 13(-1.651,7.55) 14(-3.651,7.551) 15(-5.651,7.551) 16(-7.651,7.551)
  rect 1.7x1.4 smd: 17(7.651,-5) 18(7.649,-3.002) 19(7.649,-1.004) 20(7.649,0.998) 21(7.649,2.997) 22(7.651,4.997)

## Nets
As in the schematic, except:
GND: C1.1 C2.2 C3.1 C4.1 C5.1 C6.1 C7.1 C8.1 C9.1 C10.1 C11.1 C12.1 C13.1 C16.1 C17.1 C18.1 C19.1 C20.1 C21.1 C24.1 C25.1 C26.1 C27.1 C28.1 C29.1 CN1.2 H4.2 H5.3 OLED1.7 OLED2.7 PWR.2 Q2.2 R1.1 R3.1 R5.1 R13.1 R17.1 SW1.2 U2.9 U2.10 U4.1 U4.3 U4.6 U5.2 U6.8 U6.20 U6.23 U6.35 U6.47 U7.2 U7.8
VUSB: C1.2 CHARGE.1 D1.2 Q1.1 R3.2 U4.4 U4.8 U7.5
$1N1801: CHARGE.2 R2.1
$1N7557: PWR.1 R18.2

Pads without a net: OLED1 6; OLED2 6; U2 2 4 5 6 7 11 13 14 17 18 19 20 21 22; U4 9; U5 4; U6 1 2 3 4 10 11 12 13 14 15 16 17 19 25 26 27 28 29 38 39 40 41

## Via types
v1: diameter 0.61, hole 0.305, Top Layer to Bottom Layer, 66 vias

## Routing (per net, layer and track width the routed paths; a pad name or vN(x,y) marks a point on that pad's centre or on a via; arc(x,y) is an arc through that point)
GND: length 12.3
  Top Layer w0.254: 71.01,2.51 70.97,2.51 69.37,4.11 69.37,5.38 v1(68.96,5.78) ; U6.8 53.25,5.69 v1(53.25,4.5)
  Top Layer w0.305: v1(46.32,8.38) 45.29,9.42 45.28,9.42 44.3,10.4 ; 23.62,16.53 U2.10
  Bottom Layer w0.254: 11.54,10.58 11.49,10.63 v1(10.62,10.63)
  vias: v1(5.54,6.27) v1(10.12,12.3) v1(10.26,9.24) v1(10.26,6.72) v1(14.58,8.81) v1(42.11,1.64) v1(43.64,6.32) v1(46.43,3.72) v1(51.97,13.63) v1(63.5,6.35) v1(67.46,1.44) v1(67.77,8.35) v1(71.88,5.76) v1(71.98,7.23) v1(77.93,3.06) v1(81.53,1.34)
VBAT: length 30.6
  Top Layer w0.508: C2.1 79.4,3.46 78.89,2.95 78.89,2.38 77.83,1.31 76.23,1.31 v1(75.64,1.9) ; U7.3 78.28,14.32 76.43,12.46 76.43,11.79 Q1.3 75.33,9.82 v1(76.4,9.82)
  GND w0.508: v1(76.4,9.82) 78.99,7.23 81.94,7.23 82.45,6.72 82.45,4.49 79.86,1.9 v1(75.64,1.9)
VBAT_S: length 5.8
  Bottom Layer w0.508: U7.4 79.27,11.36 CN1.1
VCC33: length 104.5
  Top Layer w0.254: v1(24.87,1.44) 25.23,1.44 R8.2 ; R9.2 43.49,9.77 v1(43.49,9.57) ; v1(54.46,8.45) 55.36,9.36 R18.1 61.16,9.36 C11.2
  Top Layer w0.305: v1(67.31,6.77) 67.31,7.64 67.06,7.89 66.41,7.89 66.39,7.91 ; 48.52,14.89 48.52,14.81 45.04,14.81 C8.2 ; 48.52,14.89 C7.2 ; 48.52,14.89 48.66,14.75 v1(49.48,14.75) 49.94,14.75 50.61,15.42 C6.2 ; 66.39,7.91 66.39,6.79 v1(66.38,6.77) ; 66.39,7.91 65.6,7.91 65.38,7.69 v1(65.38,6.77) ; v1(58.93,3.01) SW2.1 ; 47.45,8.86 47.45,11.42 U6.24 ; 47.45,8.86 47.75,9.16 50.49,9.16 U6.9 54.35,5.3 v1(54.41,5.3) ; 47.45,8.86 47.45,8.14 49.02,6.57 49.02,5.22 U6.48 ; R4.2 34.13,5.56 34.7,5 34.7,3.94 C3.2 35.73,2.91 v1(37.08,2.91) 37.12,2.95 C4.2 ; v1(40.03,2.81) 40.88,2.81 C5.2 ; v1(43.49,9.57) 43.95,10.03 U6.36 ; U2.8 24.86,1.43 v1(24.87,1.44) ; v1(65.69,15.84) H4.1
  Bottom Layer w0.254: OLED1.5 39.79,6.11 39.32,5.64 ; R12.2 56.55,3.14 v1(56.43,3.01) ; C24.2 15.98,6.72 v1(16.13,6.57) 17.1,6.57 R15.1 ; R11.1 56.09,5.58 55.99,5.58 55.71,5.3 v1(54.41,5.3) ; v1(5.78,8.38) 6.19,7.97 6.57,7.97 ; 6.57,7.97 OLED2.8 ; 6.57,7.97 6.31,7.72 6.31,6.29 6.49,6.11 OLED2.5 ; v1(24.87,1.44) 22.81,3.5 D3.2 ; 39.32,5.64 39.32,7.5 39.79,7.97 OLED1.8 ; 39.32,5.64 39.32,3.52 v1(40.03,2.81) ; v1(58.93,3.01) 60.92,3.01 D2.2 ; R16.2 16.29,3.98 v1(16.26,3.98) ; C16.2 C17.2 53.95,8.96 v1(54.46,8.45) 55.19,7.71 R10.2 ; R14.2 17.14,8.38 v1(16.14,8.38) 15.9,8.14 13.2,8.14 12.84,8.5
VCCIN: length 17.6
  Top Layer w0.305: 65.14,8.86 64.62,8.33 64.62,5.51 D1.1 ; 65.14,8.86 63.95,8.86 C10.2 ; 65.14,8.86 67.16,8.86 68.11,9.81 70.32,9.81 70.79,9.34 ; 70.79,9.34 72.39,9.34 Q1.2 ; 70.79,9.34 70.79,8.37 70.32,7.91 68.99,7.91
D+: length 83.5
  Top Layer w0.203: R6.2 39.84,6.45 39.06,5.67 39.06,1.07 39.72,0.4 84.1,0.4 84.6,0.9 84.6,16.54 83.57,17.57 73.56,17.57 U7.7
D-: length 81.7
  Top Layer w0.203: U7.6 72.31,15.89 73.66,17.24 83.47,17.24 84.29,16.41 84.29,1.02 83.98,0.71 39.85,0.71 39.42,1.13 39.42,5.17 39.9,5.66 40.79,5.66 41.4,6.27 R7.2
ESP8266_BOOT: length 33.4
  Top Layer w0.305: SW2.2 52.81,2.86 v1(48.72,2.86) 46.23,2.86 45.62,3.47 45.62,4.65 U6.44 ; R5.2 43.47,2.91 v1(42.62,2.91) ; 32.85,15.17 34.04,13.98 v1(34.04,13.78)
  GND w0.305: v1(48.72,2.86) 48.67,2.91 v1(42.62,2.91) 42.42,3.12 42.42,5.31 34.04,13.69 v1(34.04,13.78)
ESP8266_RX: length 51
  Top Layer w0.305: U2.15 11.62,15.28 11.19,14.85 8.03,14.85 v1(5.74,17.14) ; U8.1 39.42,15.41 42.82,15.41 U6.30
  Bottom Layer w0.305: U8.1 37.29,17.54 6.15,17.54 v1(5.74,17.14)
ESP8266_TX: length 43.7
  Top Layer w0.305: 45.71,11.81 42.76,14.76 37.53,14.76 U8.2 ; v1(7.01,16.78) 9.37,16.78 U2.16
  Bottom Layer w0.305: v1(7.01,16.78) 7.31,17.09 35.2,17.09 U8.2
NRST: length 85.4
  Top Layer w0.305: 9.65,1.46 7.39,1.46 v1(7.37,1.49) ; 9.65,1.46 9.65,3.22 10.41,3.98 12.9,3.98 13.62,3.26 U2.3 ; 9.65,1.46 U2.1 ; U6.7 50.5,7.74 50.5,8.09 ; v1(36.19,10.67) 36.19,11.78 ; 36.19,11.78 34.54,10.13 33.09,10.13 C9.2 32.42,10.19 31.7,9.47 31.7,7.64 32.27,7.07 R4.1 ; 36.19,11.78 SW1.1
  GND w0.305: 36.22,10.64 v1(36.19,10.67) ; 36.22,10.64 36.22,3.37 35.92,3.06 8.94,3.06 v1(7.37,1.49) ; 36.22,10.64 42.01,4.85 42.01,2.61 42.57,2.05 49.12,2.05 49.53,2.45 49.53,5.66 50.5,6.62 v1(50.5,8.09)
OLED1_SCL: length 47.6
  Top Layer w0.305: U6.21 49.58,11.44 v1(49.58,11.4)
  VCC w0.305: v1(59.23,5.61) 53.44,11.4 v1(49.58,11.4)
  Bottom Layer w0.305: v1(59.23,5.61) 58.44,5.61 R11.2 57.22,5.2 56.15,5.2 55.42,4.47 55.42,2.61 53.8,0.98 40.74,0.98 38.56,3.17 38.56,8.6 39.12,9.16 41.37,9.16 OLED1.10
OLED1_SDA: length 52.1
  Top Layer w0.305: v1(48.72,11.04) 48.72,11.75 49.47,12.5 49.94,12.5 U6.22
  VCC w0.305: v1(59.75,4.19) 53.2,10.74 49.02,10.74 v1(48.72,11.04)
  Bottom Layer w0.305: v1(59.75,4.19) 59.6,4.33 R12.1 58.06,3.08 55.5,0.53 40.18,0.53 38,2.71 38,8.86 38.97,9.83 OLED1.11
OLED2_SCL: length 59
  Top Layer w0.305: U6.45 47.4,5.72 47.4,6.72 v1(47.14,6.98)
  VCC w0.305: v1(47.14,6.98) 47.14,6.82 45.92,5.61 21.46,5.61 v1(20.44,6.62)
  Bottom Layer w0.305: v1(20.44,6.62) R15.2 17.75,5.71 16.2,5.71 14.33,3.83 14.33,1.95 13.67,1.29 8.53,1.29 6.96,2.86 5.49,2.86 4.17,4.18 4.17,7.94 5.44,9.21 OLED2.10
OLED2_SDA: length 64
  Top Layer w0.305: U6.46 48.01,5.62 v1(48.01,6.72)
  VCC w0.305: v1(48.01,6.72) 48.01,5.16 48.39,4.77 v1(20.44,4.77)
  Bottom Layer w0.305: OLED2.11 3.82,9.83 3.2,9.21 3.2,4.03 6.66,0.58 15.75,0.58 18.66,3.49 R16.1 20.38,4.84 v1(20.44,4.77)
OSCIN: length 44.3
  Top Layer w0.305: C12.2 32.78,13.22 31.09,13.22 30.03,12.16 X1.2 29.34,9.75 v1(30.58,8.5) ; v1(49.12,8.2) 50.6,6.72 50.8,6.72 51.72,5.8
  GND w0.305: v1(30.58,8.5) 30.58,15.36 31.09,15.87 33.04,15.87 34.85,14.06 34.85,13.63 43.33,5.15 47.29,5.15 49.12,6.98 v1(49.12,8.2)
OSCOUT: length 48.2
  Top Layer w0.305: v1(48.16,8.3) 50.19,6.27 50.55,6.27 U6.5 ; C13.2 32.86,2.25 31.44,2.25 30.43,3.26 29.34,3.26 29.34,6.6 v1(29.36,6.62)
  GND w0.305: v1(48.16,8.3) 47.5,7.64 46.89,7.64 46.23,6.98 44.7,6.98 43.79,7.89 42.77,7.89 37.59,13.07 37.59,16.88 37.13,17.34 30.84,17.34 28.65,15.16 28.65,7.33 v1(29.36,6.62)
SW1: length 35.4
  Top Layer w0.305: U6.18 52.08,11.89 52.96,12.77 52.96,15.56 54.64,17.24 v1(71.5,17.24)
  Bottom Layer w0.254: U7.1 79.39,17.24 v1(71.5,17.24)
SWCLK: length 15.6
  Top Layer w0.305: U6.37 43.95,7.94 v1(44.91,8.91)
  GND w0.305: H4.4 52.5,15.84 45.57,8.91 v1(44.91,8.91)
SWDIO: length 18.1
  Top Layer w0.305: U6.34 45.28,10.13 45.87,10.13 v1(46.38,10.63)
  GND w0.305: H4.3 57.25,17.39 53.14,17.39 v1(46.38,10.63)
VUSB: length 35.3
  Top Layer w0.508: U7.5 74.31,13.09 72.47,11.25 ; 72.47,11.25 72.45,11.26 Q1.1 72.47,11.25 ; 72.47,11.25 75.16,8.55 75.49,8.55 76.82,7.22 76.82,5.05 76.29,5.58 72.82,5.58 72.24,5 72.24,1.62 71.86,1.24 70.15,1.24 v1(69.81,1.58) 69.54,1.84 69.54,3.06 68.9,3.71 C1.2 67.76,4.54 D1.2 65.61,4.54 65.35,4.28 65.35,2.7 R3.2
  Bottom Layer w0.254: v1(69.81,1.58) 72.34,1.58 72.46,1.69
$1N1538: length 8.6
  Top Layer w0.305: R1.2 74.67,6.66 74.4,6.39 70.33,6.39 69.9,5.96 69.9,4.45 70.57,3.78 71.01,3.78
$1N1801: length 11.2
  Top Layer w0.305: v1(83.72,3.52) 83.71,3.51 R2.1
  Bottom Layer w0.254: v1(83.72,3.52) 82.25,2.05 78.33,2.05 77.37,1.08 75.17,1.08 CHARGE.2
$1N1811: length 7.9
  Top Layer w0.305: 76.82,3.78 77.75,3.78 78.16,4.18 81.18,4.18 81.59,3.78 81.59,2.61 82.19,2.01 R2.2
$1N4842: length 10.1
  Top Layer w0.305: U6.33 43.8,12.31 R9.1 42.52,12.87 41.05,12.87 39.88,11.7 R6.1
$1N4845: length 15
  Top Layer w0.305: U6.32 43.24,13.58 40.89,13.58 39.01,11.7 39.01,7.53 39.32,7.23 40.67,7.23 R7.1
$1N4965: length 28.9
  Top Layer w0.305: U2.12 17.62,15.28 17.9,15 24.64,15 25.76,16.12 26.91,16.12 ; 25.76,2.42 26.92,3.59 26.92,16.1 26.91,16.12 ; 26.91,16.12 Q2.3
$1N5760: length 12.6
  Bottom Layer w0.305: C14.2 50.69,1.69 46.33,1.69 44.4,3.62 41.43,3.62 OLED1.1
$1N5788: length 10.5
  Bottom Layer w0.305: C14.1 48.49,3.5 47.9,2.91 46.03,2.91 45.97,2.96 45.77,2.96 44.48,4.25 OLED1.2
$1N5816: length 11.5
  Bottom Layer w0.305: C15.1 51.71,4.54 46.94,4.54 46.69,4.79 41.5,4.79 OLED1.3
$1N5820: length 9.7
  Bottom Layer w0.305: C15.2 43.25,5.32 43.07,5.49 OLED1.4
$1N6266: length 24.1
  Bottom Layer w0.305: OLED1.9 43.55,8.59 46.06,6.08 53.91,6.08 54.71,6.88 57.19,6.88 R10.1 59.36,7.71 60.3,8.65 61.81,8.65 C18.2 61.85,7.22 D2.1
$1N6421: length 16.6
  Bottom Layer w0.305: OLED1.12 43.71,10.45 44.96,11.7 46.99,11.7 48.77,9.92 55.94,9.92 R13.2
$1N6524: length 10.7
  Bottom Layer w0.305: C19.2 49.74,12.16 44.25,12.16 43.16,11.07 OLED1.13
$1N6632: length 11.9
  Bottom Layer w0.305: OLED1.14 42.87,11.69 43.82,12.65 C20.2 C21.2
$1N7134: length 5.7
  Bottom Layer w0.305: C22.2 12.07,2.3 9.42,2.3 OLED2.1
$1N7136: length 3.9
  Bottom Layer w0.305: C22.1 10.36,4.25 OLED2.2
$1N7139: length 3.4
  Bottom Layer w0.305: C23.1 11.43,4.87 OLED2.3
$1N7142: length 5.3
  Bottom Layer w0.305: C23.2 11.96,5.86 10.77,5.86 10.4,5.49 OLED2.4
$1N7156: length 21
  Bottom Layer w0.305: 18.71,8.45 R14.1 18.66,8.16 18.14,7.64 10.77,7.64 9.81,8.59 OLED2.9 ; 18.71,8.45 20.52,8.45 21.48,7.49 D3.1 ; 18.71,8.45 20.68,10.42 C26.2
$1N7178: length 12.5
  Bottom Layer w0.305: R17.2 18.59,10.17 18.59,10.89 18.24,11.24 16.31,11.24 14.68,9.62 10.74,9.62 9.91,10.45 OLED2.12
$1N7182: length 5.7
  Bottom Layer w0.305: 12.82,10.63 12.8,10.65 12.8,11.34 12.6,11.55 10.41,11.55 9.94,11.07 OLED2.13
$1N7188: length 7.9
  Bottom Layer w0.305: C29.2 12.92,14.1 ; 12.92,14.1 12.92,12.34 C28.2 ; 12.92,14.1 12.14,13.33 9.73,13.33 OLED2.14
$1N7557: length 25.8
  Top Layer w0.305: R18.2 58.93,7.13 v1(59.54,6.52)
  GND w0.305: v1(59.54,6.52) 61.09,4.97 80.49,4.97 v1(80.77,5.25)
  Bottom Layer w0.305: PWR.1 82.13,5.25 v1(80.77,5.25)
$1N10261: length 46.1
  Top Layer w0.305: H5.1 62.58,13.72 56.12,13.72 55.56,13.16 55.56,11.56 56.13,10.99 61.21,10.99 62.1,10.1 62.1,2.56 61.75,2.2 45.97,2.2 45.06,3.12 45.06,4.79 46.07,5.8
$1N10265: length 33.4
  Top Layer w0.305: H5.2 62.64,11.12 62.64,2.05 62.23,1.64 45.77,1.64 44.6,2.81 44.6,5.12 45.63,6.15 45.71,6.15

## Copper pours and planes (outline as drawn; the poured copper is in the pictures)
GND on Top Layer: 20.65,21.15 88.16,21.15 88.16,-4 20.65,-4
GND on Bottom Layer: -3.48,21.94 89.89,21.94 89.89,-6.31 -3.48,-6.31
GND on GND: -2.36,20.36 87.66,20.36 87.66,-2.9 -2.36,-2.9
VCC33 on VCC: -1.27,19.76 86.61,19.76 86.61,-2.5 -1.27,-2.5

## Text on the board
Document Layer: TX RX可以不焊 | 开口朝上，千万别装倒了，不然和接线板不对应
Top Silkscreen Layer: TX RX | RST | BOOT0 | CLK IO G V | G 1 2

# Board PCB2
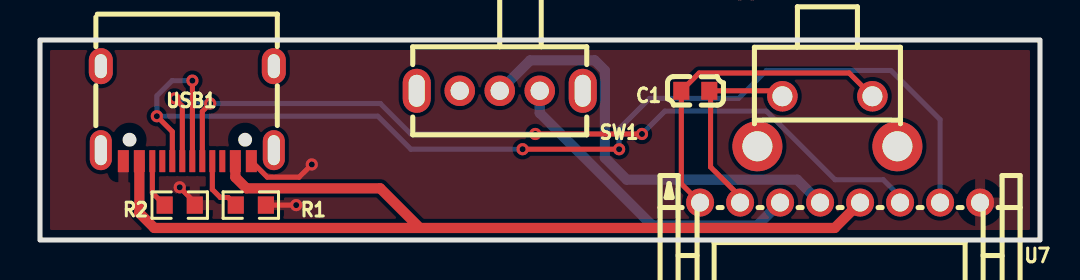
[diagram p4: board, top side]
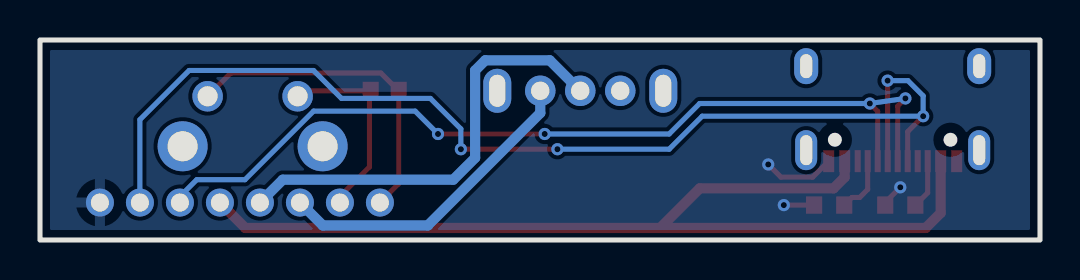
[diagram p5: board, bottom side, seen from below]

Outline 50 x 10 mm; copper layers: Top Layer, Bottom Layer. Coordinates in mm from the lower left corner of the outline.
Outline path: rectangle 0,10 50,0
Stack: Top Layer 0.035mm / Dielectric1 1.51mm FR4 er 4.5 / Bottom Layer 0.035mm

## Design rules (mm)
template: JLCPCB Capability(Two Layers Board)
spacing copperThickness1oz (default): track to track 0.102, other pairs 0.152 to 0.3
spacing copperThickness2oz: track to track 0.203, other pairs 0.152 to 0.3
track width copperThickness1oz (default): min 0.127, default 0.254, max 2.54
track width copperThickness2oz: min 0.203, default 0.254, max 2.54
differential pair differentialPair (default): width min 0.127, default 0.254, max 2.54; gap min 0.152, default 0.152
via viaSize (default): diameter min 0.5, default 0.61, max 10; hole min 0.3, default 0.305, max 6.3

## Placement (name value [footprint] x y rotation side)
C1  100nF  [C0603]  32.77 7.46 180 top
R1  5.1kΩ  [R0603]  10.54 1.75 180 top
R2  5.1kΩ  [R0603]  6.98 1.75 180 top
SW1  SK12D07VG4  [SW-TH_SK12D07VG4]  22.99 7.46 180 top
U7  S8B-PH-K-S(LF)(SN)  [CONN-TH_S8B-PH-K-S-LF-SN]  40 1.87 180 top
U8  ZX-QC66-8.5ZJ  [SW-TH_4P-L7.5-W5.5-P4.50]  39.37 5.94 0 top
USB1  TYPE-C 16PIN 2MD(073)  [USB-C-SMD_TYPE-C-6PIN-2MD-073]  7.37 6.32 180 top

## Footprints (pads in the part's own frame, mm; a bottom-side part is the same pattern mirrored in y, then rotated)
C0603
  rect 0.8x0.9 smd: 1(-0.7,0) 2(0.7,0)
CONN-TH_S8B-PH-K-S-LF-SN
  round 1.4 hole 0.9: 1(7,0) 2(5,0) 3(3,0) 4(1,0) 5(-1,0) 6(-3,0) 7(-5,0) 8(-7,0)
R0603
  rect 0.806x0.864 smd: 1(-0.753,0) 2(0.753,0)
SW-TH_4P-L7.5-W5.5-P4.50
  round 1.524 hole 1: 1(-2.25,1.25) 2(2.25,1.25)
  round 2.5 hole 1.5: 3(-3.5,-1.25) 4(3.5,-1.25)
SW-TH_SK12D07VG4
  round 1.524 hole 0.914: 1(-2,0) 2(0,0) 3(2,0)
  oval 1.4x2.2 hole 0.8x1.6: 4(4.15,0) 5(-4.15,0)
USB-C-SMD_TYPE-C-6PIN-2MD-073
  rect 0.55x1.1 smd: 1(-3.2,2.375) 2(-2.4,2.375) 11(2.4,2.375) 12(3.2,2.375)
  rect 0.3x1.1 smd: 3(-1.75,2.375) 4(-1.25,2.375) 5(-0.75,2.375) 6(-0.25,2.375) 7(0.25,2.375) 8(0.75,2.375) 9(1.25,2.375) 10(1.75,2.375)
  oval 1.1x2 hole 0.6x1.5: 13(-4.325,1.825) 14(4.325,1.825)
  oval 1.2x1.8 hole 0.6x1.2: 13(-4.325,-2.375) 14(4.325,-2.375)

## Nets
As in the schematic.

Pads without a net: SW1 3 4 5; U8 3 4; USB1 3 9 13 14

## Via types
v1: diameter 0.61, hole 0.305, Top Layer to Bottom Layer, 11 vias

## Routing (per net, layer and track width the routed paths; a pad name or vN(x,y) marks a point on that pad's centre or on a via; arc(x,y) is an arc through that point)
GND: length 6.3
  Top Layer w0.254: R2.1 7.74,1.88 v1(6.98,2.63) ; v1(13.59,3.78) 12.95,3.14 11.37,3.14 USB1.1 ; R1.1 v1(12.81,1.75)
VBAT: length 15.9
  Bottom Layer w0.508: SW1.1 24.99,6.35 30.61,0.73 35.86,0.73 U7.3
VBAT_S: length 22.2
  Bottom Layer w0.508: U7.4 37.86,3.02 29.34,3.02 28.24,4.11 28.24,8.48 27.74,8.98 24.51,8.98 SW1.2
D+: length 56.9
  Top Layer w0.254: USB1.8 6.62,5.42 v1(5.84,6.19) ; v1(24.13,4.54) v1(28.96,4.54) ; USB1.6 7.62,3.95 v1(7.62,7.97)
  Bottom Layer w0.254: v1(7.62,7.97) 6.6,7.97 5.84,7.21 v1(5.84,6.19) 16.89,6.19 18.54,4.54 v1(24.13,4.54) ; U7.7 45,6.02 42.54,8.48 36.32,8.48 34.93,7.08 30.48,7.08 28.96,5.56 v1(28.96,4.54)
D-: length 45.8
  Top Layer w0.254: USB1.5 8.12,6.43 v1(8.51,6.83) ; USB1.7 7.12,6.69 v1(6.73,7.08) ; v1(30.1,5.3) v1(24.76,5.3)
  Bottom Layer w0.254: U7.6 43,2.17 42.16,3.02 39.75,3.02 36.32,6.44 31.24,6.44 v1(30.1,5.3) ; v1(24.76,5.3) 18.54,5.3 17.02,6.83 v1(8.51,6.83) v1(6.73,7.08)
SW1: length 16.4
  Top Layer w0.254: U7.1 32.07,2.81 C1.2 32.96,8.35 40.46,8.35 U8.2
SW1_S: length 10
  Top Layer w0.254: U7.2 35,2.17 33.53,3.65 33.53,7.4 C1.1 36.85,7.46 U8.1
VUSB: length 50.5
  Top Layer w0.508: 18.99,0.6 5.72,0.6 4.97,1.35 USB1.11 ; 18.99,0.6 39.74,0.6 U7.5 ; 18.99,0.6 17.01,2.58 10.32,2.58 9.77,3.14 USB1.2
$1N308: length 2.9
  Top Layer w0.254: R1.2 9.41,2.13 9.02,2.13 8.62,2.53 USB1.4
$1N324: length 2.5
  Top Layer w0.254: R2.2 5.62,2.36 USB1.10

## Copper pours and planes (outline as drawn; the poured copper is in the pictures)
GND on Top Layer: -0.89,11.4 51.1,11.4 51.1,-1.39 -0.89,-1.39
GND on Bottom Layer: -1.27,10.89 50.93,10.89 50.93,-1.43 -1.27,-1.43
